# EAGLE design untitled (EAGLE 6.5.0)
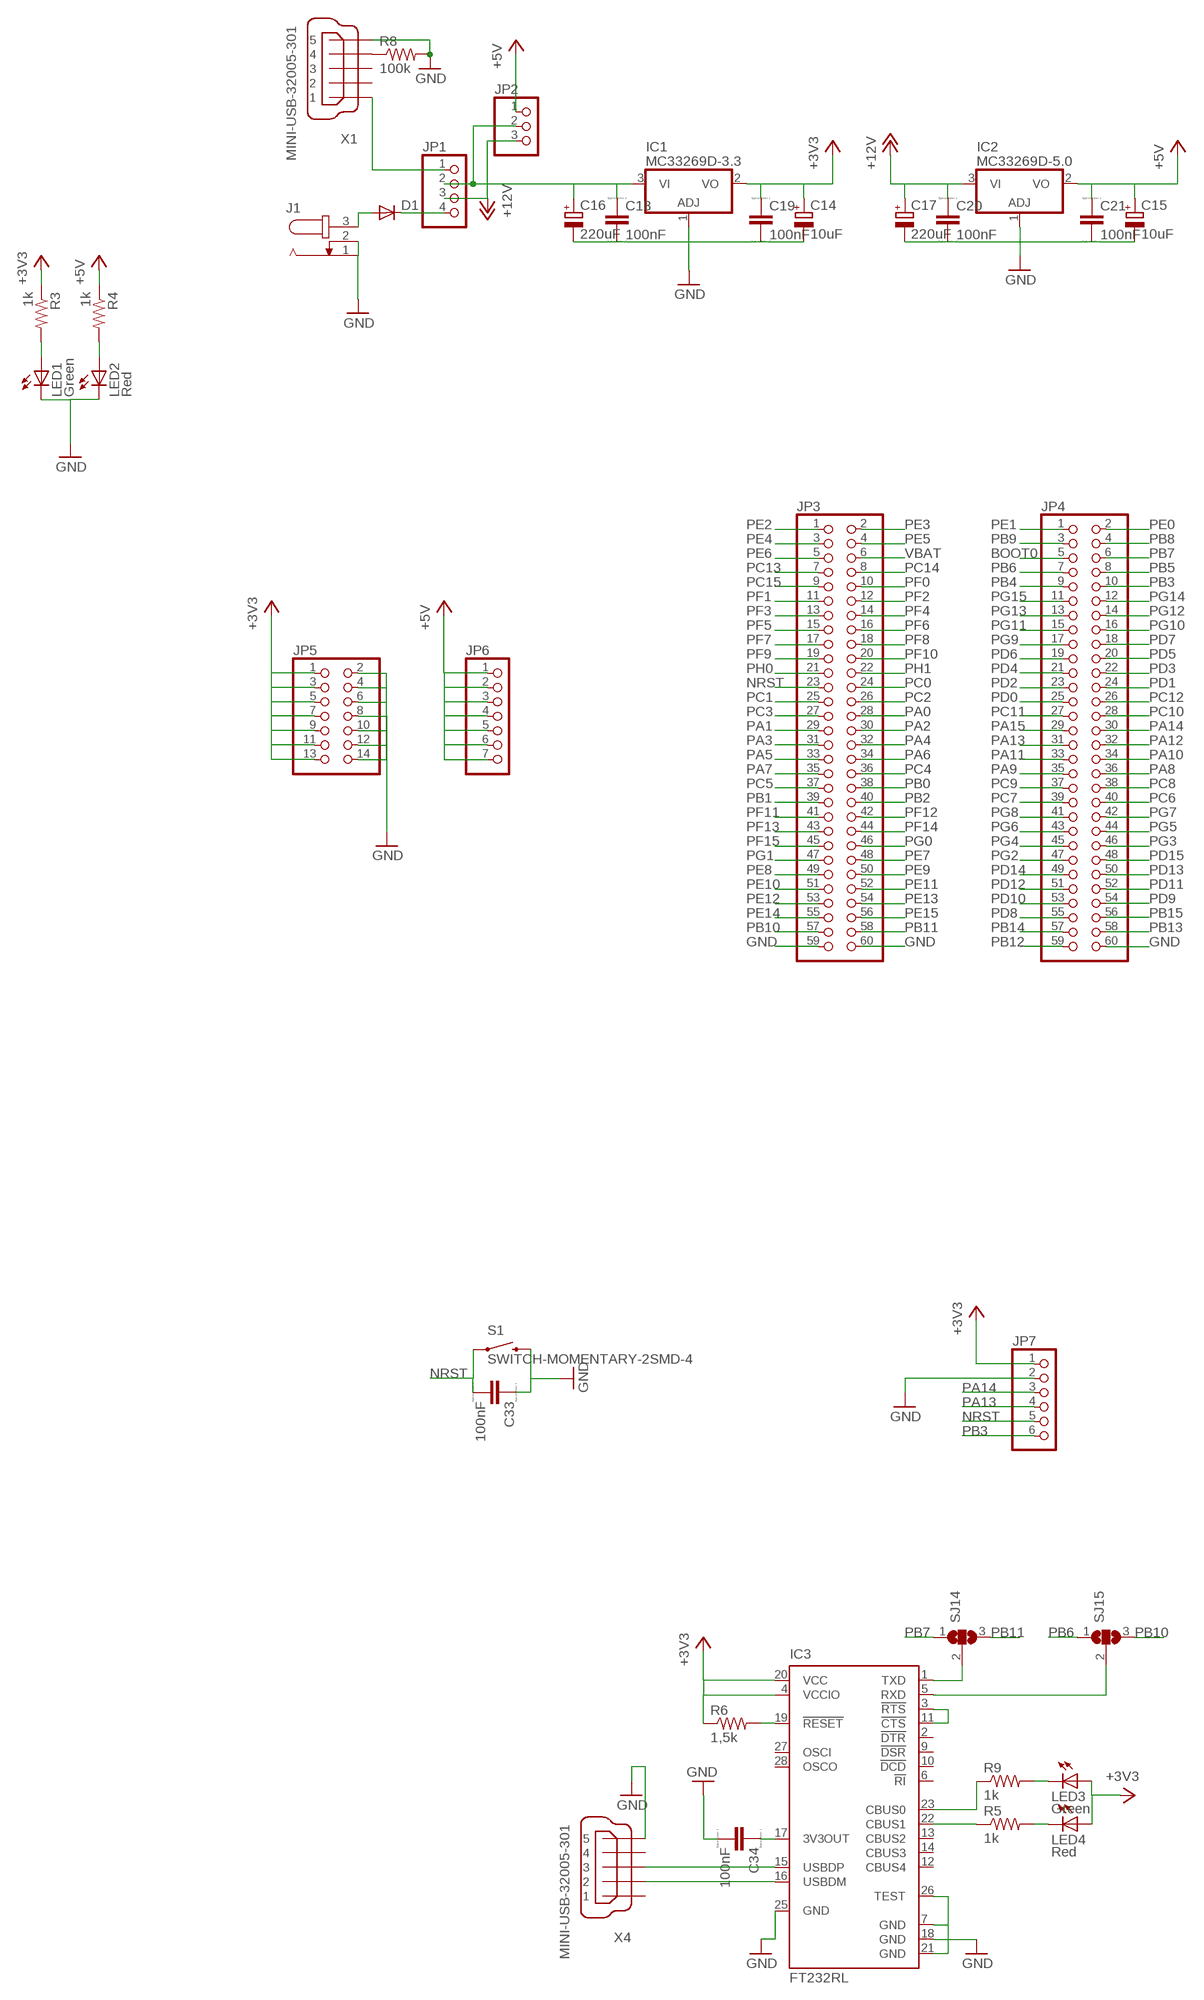
[diagram p0: schematic, sheet 1, part 1 of 2]
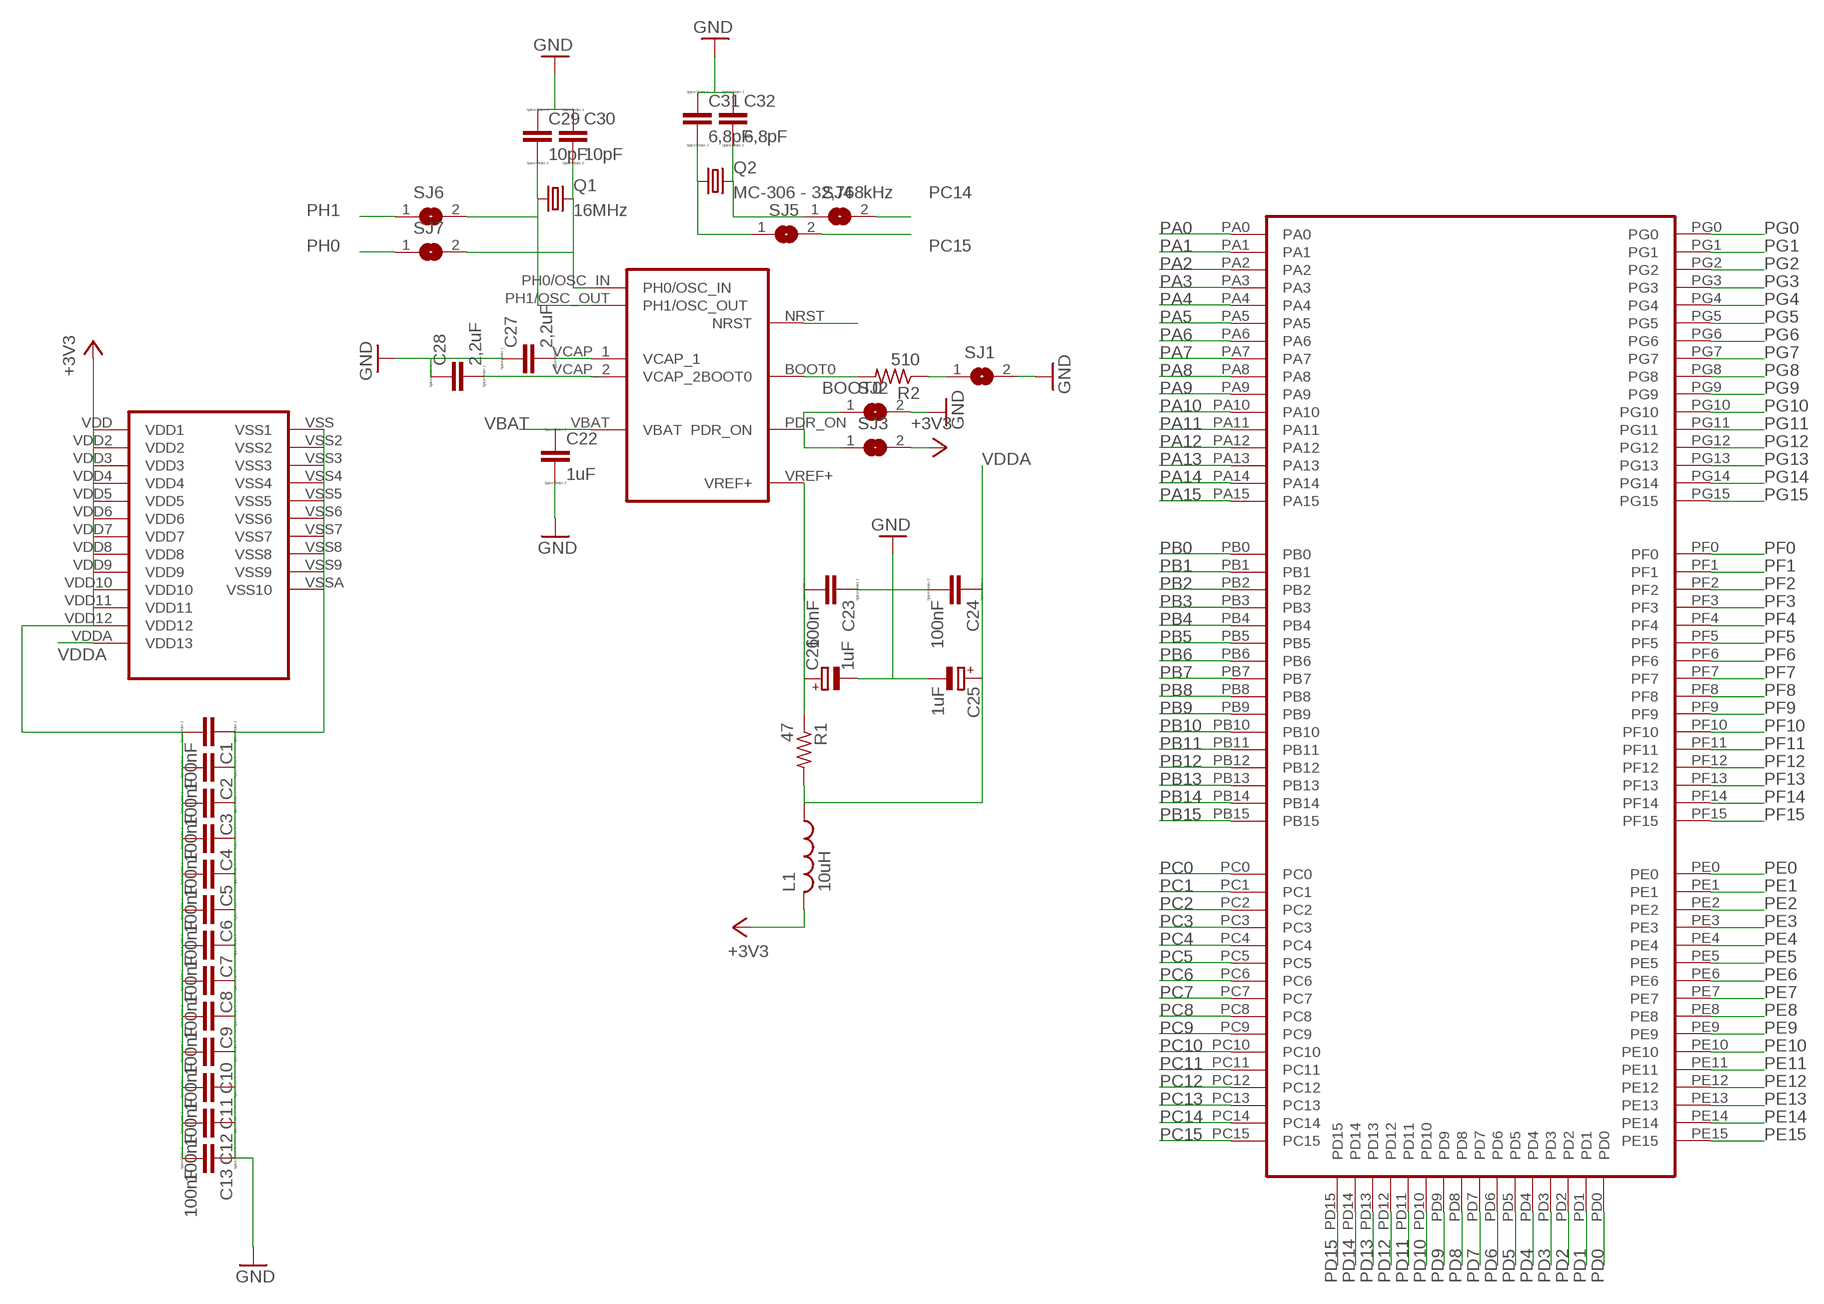
[diagram p1: schematic, sheet 1, part 2 of 2]

## Parts
C1  100nF  CC2012  [C2012]
C2  100nF  CC2012  [C2012]
C3  100nF  CC2012  [C2012]
C4  100nF  CC2012  [C2012]
C5  100nF  CC2012  [C2012]
C6  100nF  CC2012  [C2012]
C7  100nF  CC2012  [C2012]
C8  100nF  CC2012  [C2012]
C9  100nF  CC2012  [C2012]
C10  100nF  CC2012  [C2012]
C11  100nF  CC2012  [C2012]
C12  100nF  CC2012  [C2012]
C13  100nF  CC2012  [C2012]
C14  10uF  CPOL-EUSMCC  [SMC_C]
C15  10uF  CPOL-EUSMCC  [SMC_C]
C16  220uF  CPOL-EUD  [PANASONIC_D]
C17  220uF  CPOL-EUD  [PANASONIC_D]
C18  100nF  CC2012  [C2012]
C19  100nF  CC2012  [C2012]
C20  100nF  CC2012  [C2012]
C21  100nF  CC2012  [C2012]
C22  1uF  CC2012  [C2012]
C23  100nF  CC2012  [C2012]
C24  100nF  CC2012  [C2012]
C25  1uF  CPOL-EUSMCA  [SMC_A]
C26  1uF  CPOL-EUSMCA  [SMC_A]
C27  2,2uF  CC2012  [C2012]
C28  2,2uF  CC2012  [C2012]
C29  10pF  CC2012  [C2012]
C30  10pF  CC2012  [C2012]
C31  6,8pF  CC2012  [C2012]
C32  6,8pF  CC2012  [C2012]
C33  100nF  CC2012  [C2012]
C34  100nF  CC2012  [C2012]
D1  DIODE-SOD323-W  [SOD323-W]
IC1  MC33269D-3.3  [DPACK]
IC2  MC33269D-5.0  [DPACK]
IC3  FT232RL  [SSOP28]
J1  JACK-PLUG1  [SPC4078]
JP1  PINHD-1X4  [1X04]
JP2  PINHD-1X3  [1X03]
JP3  PINHD-2X30  [2X30]
JP4  PINHD-2X30  [2X30]
JP5  PINHD-2X7  [2X07]
JP6  PINHD-1X7  [1X07]
JP7  PINHD-1X6  [1X06]
L1  10uH  L-USL2012C  [L2012C]
LED1  Green  LEDCHIP-LED0805  [CHIP-LED0805]
LED2  Red  LEDCHIP-LED0805  [CHIP-LED0805]
LED3  Green  LEDCHIP-LED0805  [CHIP-LED0805]
LED4  Red  LEDCHIP-LED0805  [CHIP-LED0805]
Q1  16MHz  CRYSTALHC49UP  [HC49UP]
Q2  MC-306 - 32,768kHz  MC-306  [MC-306]
R1  47  R-US_R0805  [R0805]
R2  510  R-US_R0805  [R0805]
R3  1k  R-US_R0805  [R0805]
R4  1k  R-US_R0805  [R0805]
R5  1k  R-US_R0805  [R0805]
R6  1,5k  R-US_R0805  [R0805]
R8  100k  R-US_R0805  [R0805]
R9  1k  R-US_R0805  [R0805]
S1  SWITCH-MOMENTARY-2SMD-4  [TACTILE_SWITCH_TALL]
SJ1  SJ  [SJ]
SJ2  SJ  [SJ]
SJ3  SJ  [SJ]
SJ4  SJ  [SJ]
SJ5  SJ  [SJ]
SJ6  SJ  [SJ]
SJ7  SJ  [SJ]
SJ14  SJ2W  [SJ_2]
SJ15  SJ2W  [SJ_2]
U$1  STM32F407LQFP144  [LQFP144_20]
X1  MINI-USB-32005-301  [32005-301]
X4  MINI-USB-32005-301  [32005-301]

## Nets
+3V3: C1.2 C2.2 C3.2 C4.2 C5.2 C6.2 C7.2 C8.2 C9.2 C10.2 C11.2 C12.2 C13.2 C14.+ C19.1 IC1.2(VO) IC3.4(VCCIO) IC3.20(VCC) JP5.1 JP5.3 JP5.5 JP5.7 JP5.9 JP5.11 JP5.13 JP7.1 L1.2 LED3.A LED4.A R3.1 R6.1 SJ3.2 U$1.VDD2 U$1.VDD3 U$1.VDD4 U$1.VDD5 U$1.VDD6 U$1.VDD7 U$1.VDD8 U$1.VDD9 U$1.VDD10 U$1.VDD11 U$1.VDD12 U$1.VDD(VDD1)
+5V: C15.+ C21.1 IC2.2(VO) JP2.1 JP6.1 JP6.2 JP6.3 JP6.4 JP6.5 JP6.6 JP6.7 R4.1
+12V: C17.+ C20.1 IC2.3(VI) JP1.3 JP2.3
BOOT0: JP4.5 R2.2 U$1.BOOT0
GND: C1.1 C2.1 C3.1 C4.1 C5.1 C6.1 C7.1 C8.1 C9.1 C10.1 C11.1 C12.1 C13.1 C14.- C15.- C16.- C17.- C18.2 C19.2 C20.2 C21.2 C22.2 C23.1 C24.2 C25.- C26.- C27.1 C28.1 C29.1 C30.1 C31.1 C32.1 C33.1 C34.2 IC1.1(ADJ) IC2.1(ADJ) IC3.7(GND) IC3.18(GND) IC3.21(GND) IC3.25(GND) IC3.26(TEST) J1.1 J1.2 JP3.59 JP3.60 JP4.60 JP5.2 JP5.4 JP5.6 JP5.8 JP5.10 JP5.12 JP5.14 JP7.2 LED1.C LED2.C R8.2 S1.B2 SJ1.2 SJ2.2 U$1.VSS2 U$1.VSS3 U$1.VSS4 U$1.VSS5 U$1.VSS6 U$1.VSS7 U$1.VSS8 U$1.VSS9 U$1.VSS(VSS1) U$1.VSSA(VSS10) X1.5 X4.5
N$1: JP1.1 X1.1
N$2: D1.A J1.3
N$3: D1.C JP1.4
N$4: LED1.A R3.2
N$5: R2.1 SJ1.1
N$6: LED2.A R4.2
N$7: C16.+ C18.1 IC1.3(VI) JP1.2 JP2.2
N$8: C34.1 IC3.17(3V3OUT)
N$9: IC3.19(!RESET) R6.2
N$10: IC3.23(CBUS0) R9.1
N$11: IC3.16(USBDM) X4.2
N$12: IC3.15(USBDP) X4.3
N$13: R8.1 X1.4
N$14: IC3.1(TXD) SJ14.2
N$15: IC3.5(RXD) SJ15.2
N$24: SJ2.1 SJ3.1 U$1.PDR_ON
N$26: LED3.C R9.2
N$27: LED4.C R5.2
N$28: C31.2 Q2.1 SJ5.1
N$29: C32.2 Q2.4 SJ4.1
N$30: IC3.22(CBUS1) R5.1
N$31: IC3.3(!RTS) IC3.11(!CTS)
NRST: C33.2 JP3.23 JP7.5 S1.A2 U$1.NRST
OSC_IN: C30.2 Q1.2 SJ7.2 U$1.PH0/OSC_IN
OSC_OUT: C29.2 Q1.1 SJ6.2 U$1.PH1/OSC_OUT
PA0: JP3.28 U$1.PA0
PA1: JP3.29 U$1.PA1
PA2: JP3.30 U$1.PA2
PA3: JP3.31 U$1.PA3
PA4: JP3.32 U$1.PA4
PA5: JP3.33 U$1.PA5
PA6: JP3.34 U$1.PA6
PA7: JP3.35 U$1.PA7
PA8: JP4.36 U$1.PA8
PA9: JP4.35 U$1.PA9
PA10: JP4.34 U$1.PA10
PA11: JP4.33 U$1.PA11
PA12: JP4.32 U$1.PA12
PA13: JP4.31 JP7.4 U$1.PA13
PA14: JP4.30 JP7.3 U$1.PA14
PA15: JP4.29 U$1.PA15
PB0: JP3.38 U$1.PB0
PB1: JP3.39 U$1.PB1
PB2: JP3.40 U$1.PB2
PB3: JP4.10 JP7.6 U$1.PB3
PB4: JP4.9 U$1.PB4
PB5: JP4.8 U$1.PB5
PB6: JP4.7 SJ15.1 U$1.PB6
PB7: JP4.6 SJ14.1 U$1.PB7
PB8: JP4.4 U$1.PB8
PB9: JP4.3 U$1.PB9
PB10: JP3.57 SJ15.3 U$1.PB10
PB11: JP3.58 SJ14.3 U$1.PB11
PB12: JP4.59 U$1.PB12
PB13: JP4.58 U$1.PB13
PB14: JP4.57 U$1.PB14
PB15: JP4.56 U$1.PB15
PC0: JP3.24 U$1.PC0
PC1: JP3.25 U$1.PC1
PC2: JP3.26 U$1.PC2
PC3: JP3.27 U$1.PC3
PC4: JP3.36 U$1.PC4
PC5: JP3.37 U$1.PC5
PC6: JP4.40 U$1.PC6
PC7: JP4.39 U$1.PC7
PC8: JP4.38 U$1.PC8
PC9: JP4.37 U$1.PC9
PC10: JP4.28 U$1.PC10
PC11: JP4.27 U$1.PC11
PC12: JP4.26 U$1.PC12
PC13: JP3.7 U$1.PC13
PC14: JP3.8 SJ4.2 U$1.PC14
PC15: JP3.9 SJ5.2 U$1.PC15
PD0: JP4.25 U$1.PD0
PD1: JP4.24 U$1.PD1
PD2: JP4.23 U$1.PD2
PD3: JP4.22 U$1.PD3
PD4: JP4.21 U$1.PD4
PD5: JP4.20 U$1.PD5
PD6: JP4.19 U$1.PD6
PD7: JP4.18 U$1.PD7
PD8: JP4.55 U$1.PD8
PD9: JP4.54 U$1.PD9
PD10: JP4.53 U$1.PD10
PD11: JP4.52 U$1.PD11
PD12: JP4.51 U$1.PD12
PD13: JP4.50 U$1.PD13
PD14: JP4.49 U$1.PD14
PD15: JP4.48 U$1.PD15
PE0: JP4.2 U$1.PE0
PE1: JP4.1 U$1.PE1
PE2: JP3.1 U$1.PE2
PE3: JP3.2 U$1.PE3
PE4: JP3.3 U$1.PE4
PE5: JP3.4 U$1.PE5
PE6: JP3.5 U$1.PE6
PE7: JP3.48 U$1.PE7
PE8: JP3.49 U$1.PE8
PE9: JP3.50 U$1.PE9
PE10: JP3.51 U$1.PE10
PE11: JP3.52 U$1.PE11
PE12: JP3.53 U$1.PE12
PE13: JP3.54 U$1.PE13
PE14: JP3.55 U$1.PE14
PE15: JP3.56 U$1.PE15
PF0: JP3.10 U$1.PF0
PF1: JP3.11 U$1.PF1
PF2: JP3.12 U$1.PF2
PF3: JP3.13 U$1.PF3
PF4: JP3.14 U$1.PF4
PF5: JP3.15 U$1.PF5
PF6: JP3.16 U$1.PF6
PF7: JP3.17 U$1.PF7
PF8: JP3.18 U$1.PF8
PF9: JP3.19 U$1.PF9
PF10: JP3.20 U$1.PF10
PF11: JP3.41 U$1.PF11
PF12: JP3.42 U$1.PF12
PF13: JP3.43 U$1.PF13
PF14: JP3.44 U$1.PF14
PF15: JP3.45 U$1.PF15
PG0: JP3.46 U$1.PG0
PG1: JP3.47 U$1.PG1
PG2: JP4.47 U$1.PG2
PG3: JP4.46 U$1.PG3
PG4: JP4.45 U$1.PG4
PG5: JP4.44 U$1.PG5
PG6: JP4.43 U$1.PG6
PG7: JP4.42 U$1.PG7
PG8: JP4.41 U$1.PG8
PG9: JP4.17 U$1.PG9
PG10: JP4.16 U$1.PG10
PG11: JP4.15 U$1.PG11
PG12: JP4.14 U$1.PG12
PG13: JP4.13 U$1.PG13
PG14: JP4.12 U$1.PG14
PG15: JP4.11 U$1.PG15
PH0: JP3.21 SJ7.1
PH1: JP3.22 SJ6.1
VBAT: C22.1 JP3.6 U$1.VBAT
VCAP1: C27.2 U$1.VCAP_1
VCAP2: C28.2 U$1.VCAP_2
VDDA: C24.1 C25.+ L1.1 R1.2 U$1.VDDA(VDD13)
VREF+: C23.2 C26.+ R1.1 U$1.VREF+
Unconnected: IC3.2(!DTR) IC3.6(!RI) IC3.9(!DSR) IC3.10(!DCD) IC3.12(CBUS4) IC3.13(CBUS2) IC3.14(CBUS3) IC3.27(OSCI) IC3.28(OSCO) X1.2 X1.3 X4.1 X4.4

## Library data of the parts
C1-C13 C18-C24 C27-C34 = eagle-ltspice:C: CAPACITOR, European symbol; SPICEMODEL: NONE; SPICEPREFIX: C
C14-C17 = resistor:CPOL-EU: POLARIZED CAPACITOR, European symbol
C25 C26 = rcl:CPOL-EU: POLARIZED CAPACITOR, European symbol
D1 = diode:DIODE-: DIODE
IC1 IC2 = linear:MC33269?*: Adjustable Output Low Dropout Voltage Regulator 800 mA Source: http://www.onsemi.com/pub/Collateral/MC33269-D.PDF
IC3 = ftdichip:FT232R: Source: http://www.ftdichip.com/Documents/DataSheets/DS_FT232R_v104.pdf; MPN: FT232RL; OC_FARNELL: 1146032; OC_NEWARK: 91K9918
J1 = con-jack:JACK-PLUG: DC POWER JACK Power Jack, DC, Right Angle, Through Hole, Rated 5A at 16VDC, PC Terminals Distributor: Farnell (www.Farnell.de) Drawing: 84N1161.pdf / 84N1162.pdf Manufacturer: SPC Technology (www.spctechnology.com) Type: SPC4077 / SPC 4078; OC_FARNELL: unknown; OC_NEWARK: unknown
JP1 = pinhead:PINHD-1X4: PIN HEADER
JP2 = pinhead:PINHD-1X3: PIN HEADER
JP3 JP4 = pinhead:PINHD-2X30: PIN HEADER
JP5 = pinhead:PINHD-2X7: PIN HEADER
JP6 = pinhead:PINHD-1X7: PIN HEADER
JP7 = pinhead:PINHD-1X6: PIN HEADER
L1 = rcl:L-US: INDUCTOR, American symbol
LED1-LED4 = led:LED: LED OSRAM: - CHIPLED LG R971, LG N971, LY N971, LG Q971, LY Q971, LO R971, LY R971 LH N974, LH R974 LS Q976, LO Q976, LY Q976 LO Q996 - Hyper CHIPLED LW Q18S LB Q993, LB Q99A, LB R99A - SideLED LS A670, LO A670, LY A670, LG A670, LP A670 LB A673, LV A673, LT A673, LW A673 LH A674 LY A675 LS A676, LA A676, LO A676, LY A676, LW A676 LS A679, LY A679, LG A679 - Hyper Micro SIDELED® LS Y876, LA Y876, LO Y876, LY Y876 LT Y87S - SmartLED LW L88C, LW L88S LB L89C, LB L89S, LG L890 LS L89K, LO L89K, LY L89K LS L896, LA L896, LO L896, LY L896 - TOPLED LS T670, LO T670, LY T670, LG T670, LP T670 LSG T670, LSP T670, LSY T670, LOP T670, LYG T670 LG T671, LOG T671, LSG T671 LB T673, LV T673, LT T673, LW T673 LH T674 LS T676, LA T676, LO T676, LY T676, LB T676, LH T676, LSB T676, LW T676 LB T67C, LV T67C, LT T67C, LS T67K, LO T67K, LY T67K, LW E67C LS E67B, LA E67B, LO E67B, LY E67B, LB E67C, LV E67C, LT E67C LW T67C LS T679, LY T679, LG T679 LS T770, LO T770, LY T770, LG T770, LP T770 LB T773, LV T773, LT T773, LW T773 LH T774 LS E675, LA E675, LY E675, LS T675 LS T776, LA T776, LO T776, LY T776, LB T776 LHGB T686 LT T68C, LB T68C - Hyper Mini TOPLED® LB M676 - Mini TOPLED Santana® LG M470 LS M47K, LO M47K, LY M47K Source: http://www.osram.convergy.de LUXEON: - LUMILED® LXK2-PW12-R00, LXK2-PW12-S00, LXK2-PW14-U00, LXK2-PW14-V00 LXK2-PM12-R00, LXK2-PM12-S00, LXK2-PM14-U00 LXK2-PE12-Q00, LXK2-PE12-R00, LXK2-PE12-S00, LXK2-PE14-T00, LXK2-PE14-U00 LXK2-PB12-K00, LXK2-PB12-L00, LXK2-PB12-M00, LXK2-PB14-N00, LXK2-PB14-P00, LXK2-PB14-Q00 LXK2-PR12-L00, LXK2-PR12-M00, LXK2-PR14-Q00, LXK2-PR14-R00 LXK2-PD12-Q00, LXK2-PD12-R00, LXK2-PD12-S00 LXK2-PH12-R00, LXK2-PH12-S00 LXK2-PL12-P00, LXK2-PL12-Q00, LXK2-PL12-R00 Source: www.luxeon.com KINGBRIGHT: KA-3528ASYC Source: www.kingbright.com
Q1 = crystal:CRYSTAL: CRYSTAL; OC_FARNELL: unknown; OC_NEWARK: unknown
Q2 = crystal:MC-306: kHz RANGE CRYSTAL UNIT SMD Source: MC-306_405_406_E07X.PDF Homepage <http://www.epsontoyocom.co.jp>; MPN: MC-306 60.0KHZ 100PPM ,12.5PF; OC_FARNELL: 1278040; OC_NEWARK: 31M5576
R1-R6 R8 R9 = resistor:R-US_: RESISTOR, American symbol
S1 = SparkFun-Electromechanical:SWITCH-MOMENTARY-2: Various NO switches- pushbuttons, reed, etc; PROD_ID: SWCH-11966
SJ1-SJ7 = jumper:SJ: SMD solder JUMPER
SJ14 SJ15 = jumper:SJ2W: SMD solder JUMPER
U$1 = Stworzone:STM32F407
X1 X4 = con-cypressindustries:MINI-USB-: MINI USB-B Conector Source: www.cypressindustries.com; OC_FARNELL: unknown; OC_NEWARK: unknown

## Board
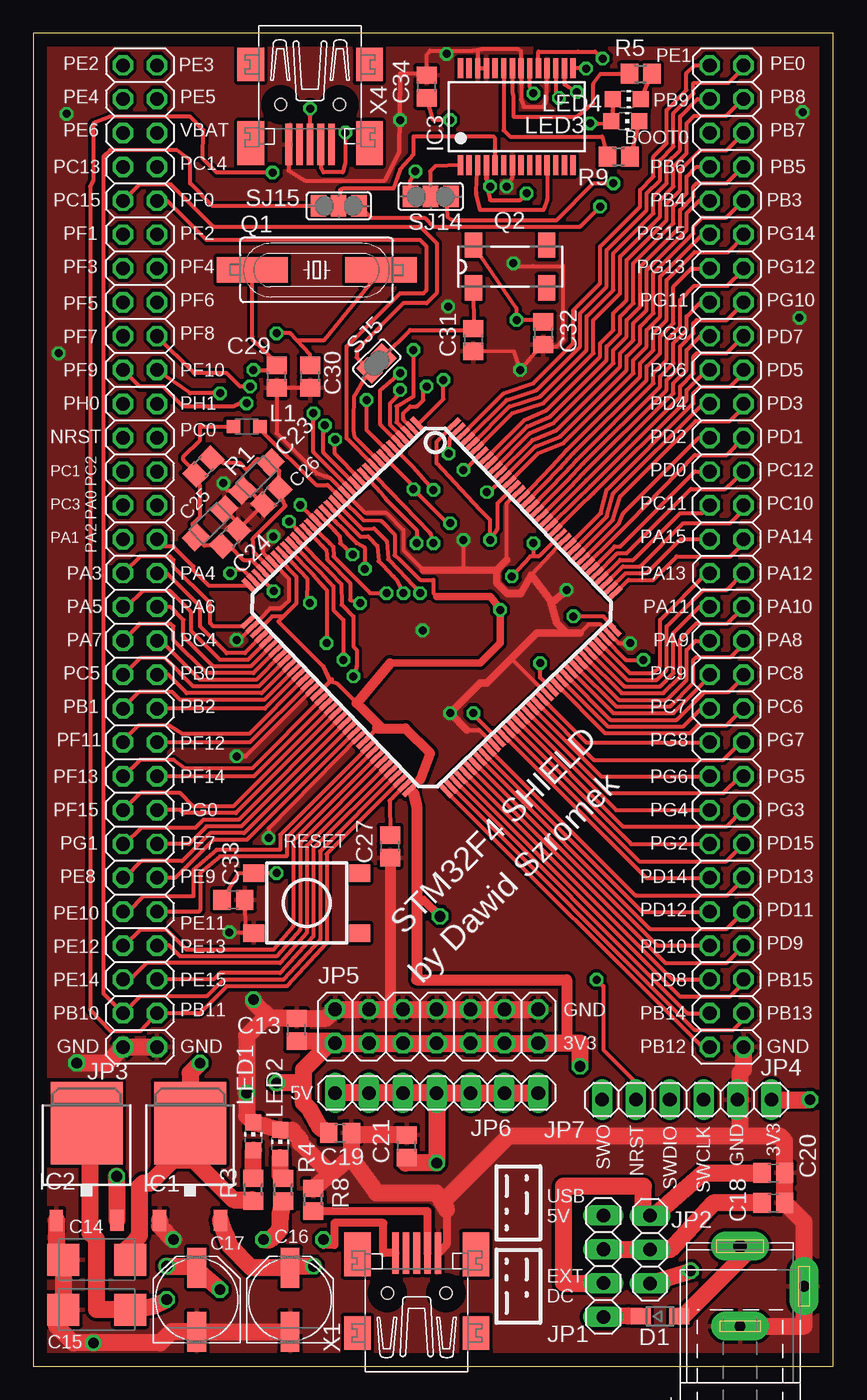
[diagram p2: board, top side]
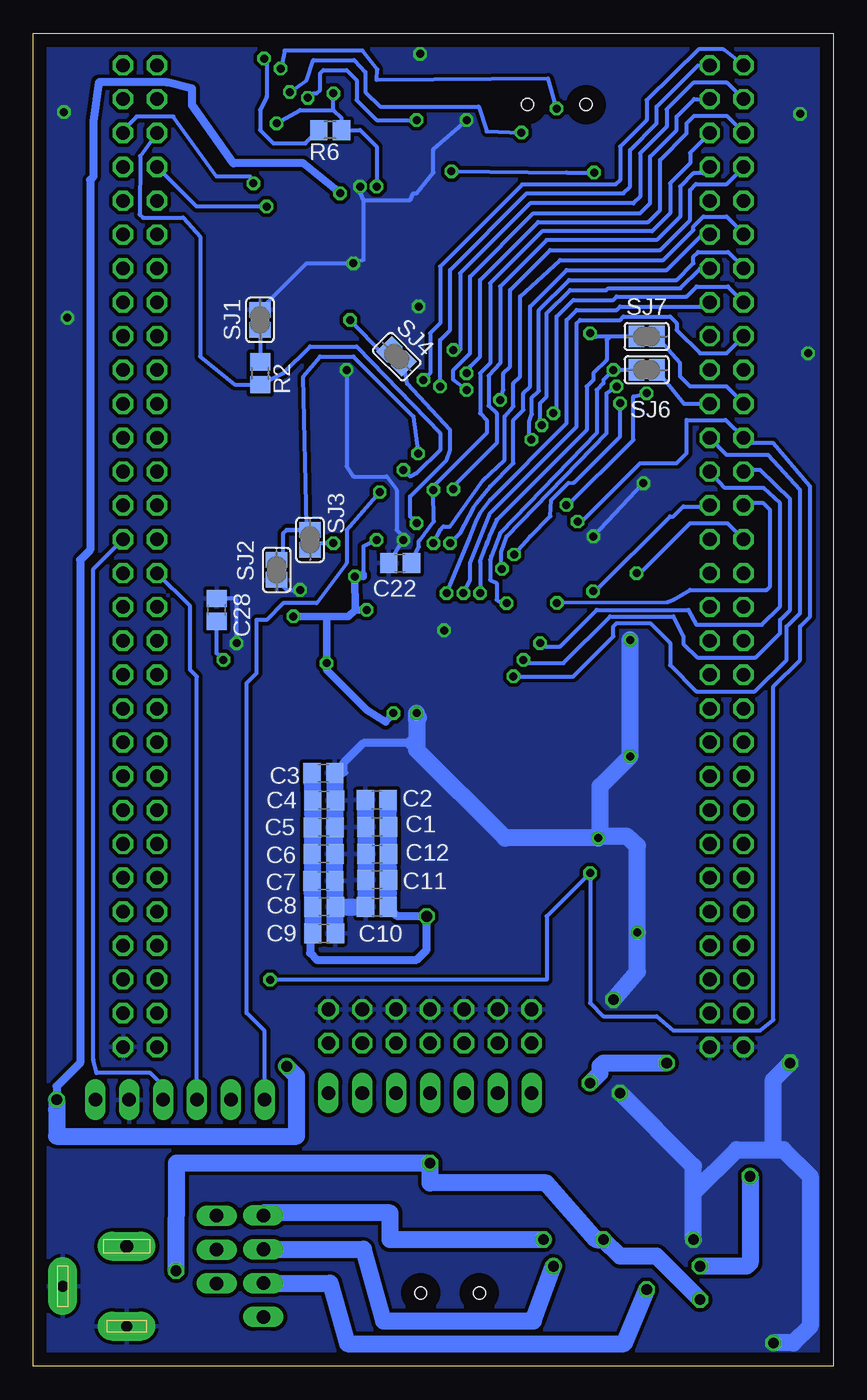
[diagram p3: board, bottom side, seen from below]

Size 60 x 100 mm. Coordinates in mm from the lower left corner, seen from the top.
Outline: 0,0 60,0 60,100 0,100 0,0
Copper layers (1*16): Top 0.035mm / dielectric 1.5mm / Bottom 0.035mm
Design rules "elecrow": minimum track width 10mil, minimum drill 12mil, track to track 8mil, track to pad 8mil, pad to pad 8mil, via to via 8mil, smd to smd 8mil, copper to edge 40mil, drill to drill 8mil, minimum pad ring 10mil, minimum via ring 8mil, stop-mask expansion 4mil, vias tented up to drill 0mil, thermal gap 10mil

### Footprints (pad centres in the part's own frame; a part is rotated, then mirrored left to right if it is on the bottom)
C2012 = smd 1.3 x 1.5: 1 -0.85,0; 2 0.85,0
SMC_C = smd 2.4 x 2.4: + -2.5,0; - 2.5,0
PANASONIC_D = smd 3 x 1.4: + 2.4,0; - -2.4,0
SMC_A = smd 1.6 x 1.4: + -1.5,0; - 1.5,0
SOD323-W = smd 1.5 x 1.2: A 1.45,0; C -1.45,0
DPACK = smd 1 x 1.6: 1 -2.28,-4.8; 3 2.28,-4.8 | smd 5.4 x 6.2: 2 0,2.5
SSOP28 = smd 0.4 x 1.5: 1 -4.225,-3.625; 2 -3.575,-3.625; 3 -2.925,-3.625; 4 -2.275,-3.625; 5 -1.625,-3.625; 6 -0.975,-3.625; 7 -0.325,-3.625; 8 0.325,-3.625; 9 0.975,-3.625; 10 1.625,-3.625; 11 2.275,-3.625; 12 2.925,-3.625; 13 3.575,-3.625; 14 4.225,-3.625; 15 4.225,3.625; 16 3.575,3.625; 17 2.925,3.625; 18 2.275,3.625; 19 1.625,3.625; 20 0.975,3.625; 21 0.325,3.625; 22 -0.325,3.625; 23 -0.975,3.625; 24 -1.625,3.625; 25 -2.275,3.625; 26 -2.925,3.625; 27 -3.575,3.625; 28 -4.225,3.625
SPC4078 = drill 0.8 pad 2.184 long: 1 -3,0; 2 0,-4.8 | drill 1 pad 2.184 long: 3 3,0
1X04 = drill 1.016 long: 1 -3.81,0; 2 -1.27,0; 3 1.27,0; 4 3.81,0
1X03 = drill 1.016 long: 1 -2.54,0; 2 0,0; 3 2.54,0
2X30 = drill 1.016 octagon: 1 -38.1,-1.27; 2 -38.1,1.27; 3 -35.56,-1.27; 4 -35.56,1.27; 5 -33.02,-1.27; 6 -33.02,1.27; 7 -30.48,-1.27; 8 -30.48,1.27; 9 -27.94,-1.27; 10 -27.94,1.27; 11 -25.4,-1.27; 12 -25.4,1.27; 13 -22.86,-1.27; 14 -22.86,1.27; 15 -20.32,-1.27; 16 -20.32,1.27; 17 -17.78,-1.27; 18 -17.78,1.27; 19 -15.24,-1.27; 20 -15.24,1.27; 21 -12.7,-1.27; 22 -12.7,1.27; 23 -10.16,-1.27; 24 -10.16,1.27; 25 -7.62,-1.27; 26 -7.62,1.27; 27 -5.08,-1.27; 28 -5.08,1.27; 29 -2.54,-1.27; 30 -2.54,1.27; 31 0,-1.27; 32 0,1.27; 33 2.54,-1.27; 34 2.54,1.27; 35 5.08,-1.27; 36 5.08,1.27; 37 7.62,-1.27; 38 7.62,1.27; 39 10.16,-1.27; 40 10.16,1.27; 41 12.7,-1.27; 42 12.7,1.27; 43 15.24,-1.27; 44 15.24,1.27; 45 17.78,-1.27; 46 17.78,1.27; 47 20.32,-1.27; 48 20.32,1.27; 49 22.86,-1.27; 50 22.86,1.27; 51 25.4,-1.27; 52 25.4,1.27; 53 27.94,-1.27; 54 27.94,1.27; 55 30.48,-1.27; 56 30.48,1.27; 57 33.02,-1.27; 58 33.02,1.27; 59 35.56,-1.27; 60 35.56,1.27
2X07 = drill 1.016 octagon: 1 -7.62,-1.27; 2 -7.62,1.27; 3 -5.08,-1.27; 4 -5.08,1.27; 5 -2.54,-1.27; 6 -2.54,1.27; 7 0,-1.27; 8 0,1.27; 9 2.54,-1.27; 10 2.54,1.27; 11 5.08,-1.27; 12 5.08,1.27; 13 7.62,-1.27; 14 7.62,1.27
1X07 = drill 1.016 long: 1 -7.62,0; 2 -5.08,0; 3 -2.54,0; 4 0,0; 5 2.54,0; 6 5.08,0; 7 7.62,0
1X06 = drill 1.016 long: 1 -6.35,0; 2 -3.81,0; 3 -1.27,0; 4 1.27,0; 5 3.81,0; 6 6.35,0
L2012C = smd 1 x 1: 1 -1,0; 2 1,0
CHIP-LED0805 = smd 1.2 x 1.2: A 0,-1.05; C 0,1.05
HC49UP = smd 5.334 x 1.93: 1 -4.826,0; 2 4.826,0
MC-306 = smd 1.3 x 1.9: 1 -2.75,-1.6; 2 2.75,-1.6; 3 2.75,1.6; 4 -2.75,1.6
R0805 = smd 1.3 x 1.5: 1 -0.85,0; 2 0.85,0
TACTILE_SWITCH_TALL = smd 1.55 x 1.3: A1 -3.975,-2.25; A2 3.975,-2.25; B1 -3.975,2.25; B2 3.975,2.25
SJ = smd 1.168 x 1.6: 1 -0.762,0; 2 0.762,0
SJ_2 = smd 1.168 x 1.6: 1 -1.524,0; 2 0,0; 3 1.524,0
LQFP144_20 = smd 0.35 x 1.35: BOOT0 -5.75,10.625; PA3 -8.75,-10.625; PA4 -7.25,-10.625; PA5 -6.75,-10.625; PA6 -6.25,-10.625; PA7 -5.75,-10.625; PA14 8.75,10.625; PA15 8.25,10.625; PB0 -4.25,-10.625; PB1 -3.75,-10.625; PB2 -3.25,-10.625; PB3 -3.25,10.625; PB4 -3.75,10.625; PB5 -4.25,10.625; PB6 -4.75,10.625; PB7 -5.25,10.625; PB8 -6.25,10.625; PB9 -6.75,10.625; PB10 7.25,-10.625; PB11 7.75,-10.625; PC4 -5.25,-10.625; PC5 -4.75,-10.625; PC10 7.75,10.625; PC11 7.25,10.625; PC12 6.75,10.625; PD0 6.25,10.625; PD1 5.75,10.625; PD2 5.25,10.625; PD3 4.75,10.625; PD4 4.25,10.625; PD5 3.75,10.625; PD6 2.25,10.625; PD7 1.75,10.625; PDR_ON -8.25,10.625; PE0 -7.25,10.625; PE1 -7.75,10.625; PE7 1.75,-10.625; PE8 2.25,-10.625; PE9 2.75,-10.625; PE10 4.25,-10.625; PE11 4.75,-10.625; PE12 5.25,-10.625; PE13 5.75,-10.625; PE14 6.25,-10.625; PE15 6.75,-10.625; PF11 -2.75,-10.625; PF12 -2.25,-10.625; PF13 -0.75,-10.625; PF14 -0.25,-10.625; PF15 0.25,-10.625; PG0 0.75,-10.625; PG1 1.25,-10.625; PG9 1.25,10.625; PG10 0.75,10.625; PG11 0.25,10.625; PG12 -0.25,10.625; PG13 -0.75,10.625; PG14 -1.25,10.625; PG15 -2.75,10.625; VCAP_1 8.25,-10.625; VDD3 -7.75,-10.625; VDD4 -1.25,-10.625; VDD5 3.75,-10.625; VDD6 8.75,-10.625; VDD10 2.75,10.625; VDD11 -2.25,10.625; VDD12 -8.75,10.625; VSS2 -8.25,-10.625; VSS3 -1.75,-10.625; VSS4 3.25,-10.625; VSS8 3.25,10.625; VSS9 -1.75,10.625 | smd 1.35 x 0.35: NRST -10.625,-3.25; PA0 -10.625,-7.75; PA1 -10.625,-8.25; PA2 -10.625,-8.75; PA8 10.625,4.75; PA9 10.625,5.25; PA10 10.625,5.75; PA11 10.625,6.25; PA12 10.625,6.75; PA13 10.625,7.25; PB12 10.625,-8.75; PB13 10.625,-8.25; PB14 10.625,-7.75; PB15 10.625,-7.25; PC0 -10.625,-3.75; PC1 -10.625,-4.25; PC2 -10.625,-4.75; PC3 -10.625,-5.25; PC6 10.625,2.75; PC7 10.625,3.25; PC8 10.625,3.75; PC9 10.625,4.25; PC13 -10.625,5.75; PC14 -10.625,5.25; PC15 -10.625,4.75; PD8 10.625,-6.75; PD9 10.625,-6.25; PD10 10.625,-5.75; PD11 10.625,-5.25; PD12 10.625,-4.75; PD13 10.625,-4.25; PD14 10.625,-2.75; PD15 10.625,-2.25; PE2 -10.625,8.75; PE3 -10.625,8.25; PE4 -10.625,7.75; PE5 -10.625,7.25; PE6 -10.625,6.75; PF0 -10.625,4.25; PF1 -10.625,3.75; PF2 -10.625,3.25; PF3 -10.625,2.75; PF4 -10.625,2.25; PF5 -10.625,1.75; PF6 -10.625,0.25; PF7 -10.625,-0.25; PF8 -10.625,-0.75; PF9 -10.625,-1.25; PF10 -10.625,-1.75; PG2 10.625,-1.75; PG3 10.625,-1.25; PG4 10.625,-0.75; PG5 10.625,-0.25; PG6 10.625,0.25; PG7 10.625,0.75; PG8 10.625,1.25; PH0/OSC_IN -10.625,-2.25; PH1/OSC_OUT -10.625,-2.75; VBAT -10.625,6.25; VCAP_2 10.625,7.75; VDD -10.625,0.75; VDD2 -10.625,-5.75; VDD7 10.625,-3.25; VDD8 10.625,2.25; VDD9 10.625,8.75; VDDA -10.625,-7.25; VREF+ -10.625,-6.75; VSS -10.625,1.25; VSS5 10.625,-3.75; VSS6 10.625,1.75; VSS7 10.625,8.25; VSSA -10.625,-6.25
32005-301 = smd 3.1 x 0.5: 1 3,1.6; 2 3,0.8; 3 3,0; 4 3,-0.8; 5 3,-1.6 | smd 2.5 x 2: M1 -3,-4.45; M2 -3,4.45 | smd 3.3 x 2: M3 2.9,4.45; M4 2.9,-4.45 | hole 0.9: 0,2.2; 0,-2.2

### Placement (x,y rotation side)
C1  34.22,40.46 0 bottom
C2  34.25,42.48 0 bottom
C3  38.25,44.5 180 bottom
C4  38.2,42.46 180 bottom
C5  38.22,40.43 180 bottom
C6  38.23,38.45 180 bottom
C7  38.24,36.42 180 bottom
C8  38.19,34.46 180 bottom
C9  38.2,32.47 180 bottom
C10  34.23,34.44 0 bottom
C11  34.22,36.49 0 bottom
C12  34.21,38.42 0 bottom
C13  19.75,25.25 270 top
C14  4.75,8 180 top
C15  4.75,4.25 180 top
C16  19.25,5 90 top
C17  12.25,5 90 top
C18  55.5,12.25 0 top
C19  23,17.5 0 top
C20  55.5,14.5 0 top
C21  28,16.5 90 top
C22  32.5,60.25 180 bottom
C23  17.85,65.25 45 top
C24  14.75,62.16 45 top
C25  13.25,63.25 45 top
C26  16.75,66.75 225 top
C27  26.75,39 90 top
C28  46.25,56.75 270 bottom
C29  18.25,74.25 90 top
C30  20.75,74.25 90 top
C31  33,77 90 top
C32  38.25,77.5 90 top
C33  15,35 180 top
C34  29.5,96 90 top
D1  47,3.75 0 top
IC1  11.75,15.75 0 top
IC2  4,15.75 0 top
IC3  36.25,93.75 0 top
J1  53,6 90 top
JP1  42.75,7.5 270 top
JP2  46.25,8.75 90 top
JP3  8,59.5 270 top
JP4  52,59.5 270 top
JP5  30.25,25.5 0 top
JP6  30.25,20.5 0 top
JP7  49,20 180 top
L1  16,70.5 0 top
LED1  16.5,17.25 0 top
LED2  18.5,16.7 0 top
LED3  44.4,93.4 270 top
LED4  44.5,95.05 270 top
Q1  21.25,82.25 0 top
Q2  35.75,82.5 0 top
R1  12.75,67.5 225 top
R2  43,74.5 270 bottom
R3  16.5,13.25 90 top
R4  18.75,13.25 90 top
R5  45.55,96.95 0 top
R6  37.75,92.75 180 bottom
R8  21,12.5 90 top
R9  43.9,90.75 0 top
S1  20.5,34.75 180 top
SJ1  43,78.5 90 bottom
SJ2  41.75,59.75 270 bottom
SJ3  39.25,62 270 bottom
SJ4  32.75,75.75 315 bottom
SJ5  25.75,75.25 225 top
SJ6  14,74.75 180 bottom
SJ7  14,77.25 180 bottom
SJ14  29.8,87.75 180 top
SJ15  22.9,87.05 180 top
U$1  29.87,56.93 313.8 top
X1  28.75,5.5 90 top
X4  20.75,94.65 270 top

### Tracks (layer width: path | path; a pad name or v marks a point on that pad's centre or on a via)
+3V3  (via drill 0.6, 0.8)
  Top 0.292: 28.5,43 28.5,43.02 U$1.VDD6 29,44 | v33,49 33,48.89 U$1.VDD7 | U$1.VDD2 18.38,60.62 19.73,59.23 19.73,57.22 18.75,56.25 | 18.75,56.25 18.38,55.88 21.75,52.5 | 18.75,56.25 17.92,56.25 U$1.VDD3 | U$1.VDD4 21.39,50.48 | 21.39,50.48 22.28,51.37 21.78,52.47 21.75,52.5 | 22.39,51.36 22.25,51.5 21.75,52.5 | 21.39,50.48 21.39,50.52 22.39,51.52 22.39,51.36 | 22.39,51.36 22.75,51.25 24.25,49.75 | 26,48 25.75,47.82 U$1.VDD5 24.8,46.89 25.76,47.85 | U$1.VDD11 34.82,64.75 34.82,62.82 34.75,62.75 v34.25,62 34.25,63.5 33.5,64.25 30.25,67.75 30.25,69.37 U$1.VDD12 | U$1.VDD10 37.89,60.76 37.5,60.76 | 37.5,60.76 37.26,60.76 v35.88,59.25 | U$1.VDD9 43.54,55.46 42.75,56.25 v40.5,56.25 | L1.2 17.06,70.25 21.2,66.11 22.07,66.11 U$1.VDD 24.77,63.45 26.13,63.4 27.1,62.4 27.1,60.85 27.5,60.5 29,59 30,59 30,58 30.25,57.75 | U$1.VDD8 38,51.67 v38,52.75 | v37.5,61.75 37.5,60.76 | 43.45,94.2 LED3.A | LED4.A 43.45,94.2 | 43.45,94.2 43.45,93.1 42.35,93.2 v41.75,93.25 | v37.5,95.5 37.23,96.03 IC3.20 | v34.25,88.5 33.98,89.03 IC3.4 34,90.35 34,88.75 v34.25,88.5 | v34.25,88.5 34,88.5 34.25,87.5 36.5,87.5 v37,88
  Top 0.559: 26.75,52.75 33.5,52.75 35,54.25 v35,56.75 34.5,57.5 34.25,57.75 30.25,57.75
  Top 0.61: v30.5,33.75 29.25,35 28.75,35
  Top 0.762: 26.75,52.75 24.25,49.75 26,48 | 25.76,47.85 27.9,47.85 29.75,46 29,44
  Top 0.813: 28.5,43 28.75,42 28.75,35 28.75,29 40,29 40,24.23
  Top 1.27: C14.+ 6.75,8.5 7.75,9.5 7.75,9.54 7.9,9.69 7.9,9.77 7.98,9.85 7.98,13.48 8.25,13.75 8.75,13.75 10.5,15.5 | 10.5,15.5 10.5,17 IC1.2 11.75,22 v12.5,22.75 | 10.5,15.5 12,15.5 15,12.5 16.4,12.5 R3.1 | C13.2 22.46,24.4 JP5.1 | JP5.1 JP5.3 JP5.5 JP5.7 JP5.9 JP5.11 JP5.13 40,24.23 41.02,24.23 v41,22.5 | JP5.1 22.23,24.23 20.25,22.25 20.25,21 | C19.1 21.5,17.9 20.75,19.25 20.25,19.75 20.25,21 | 20.25,21 20,21.25 v18.25,21.25 | JP7.1 v58.25,20
  Bottom 0.292: 33,49.1 v33,49 v33,48.99 | SJ3.2 38.74,61.75 v37.5,61.75 | v41.75,93.25 40,94.25 37.5,94.25 | 37.5,94.25 36.9,93.65 R6.1 35.5,92.75 34.25,91.5 v34.25,88.5 | 37.5,94.25 v37.5,95.5 | 38,56 37.75,56.25 | v34.25,62 35.25,61.5 35.25,59.38
  Bottom 0.559: 35.87,56.75 v35.88,59.25 35.25,59.38 35.25,59.25 | v40.5,56.25 37.75,56.25 36.37,56.25 35.87,56.75 | v33,48.99 33.57,48.32 35,49.25 38,52.25 v38,52.75 38,56 | v35,56.75 35.87,56.75
  Bottom 0.61: v37,88 39.75,90.25 45,90.25 48.1,94.6 48.09,95.85 49.99,96.33 55.08,96.33 55.5,93.41 55.5,89.25 55.75,89 55.75,61.25 56.5,60.5 56.5,22.75 58.25,21 58.25,19.25 | C9.2 39.25,32.27 39.25,31 38.75,30.5 31.25,30.5 30.5,31.25 v30.5,33.75 32.69,33.75 C10.2
  Bottom 1.27: v18.25,21.25 17.5,22 17.5,22.5 17.25,22.75 v12.5,22.75 | v58.25,20 58.25,19.25 58.25,17.25 40.25,17.25 40.25,21.75 v41,22.5 | C3.2 39.1,43.76 C4.2 39.05,41.45 C5.2 39.07,38.96 C6.2 39.08,37.43 C7.2 39.09,35.51 C8.2 39.04,33.73 C9.2 | C10.2 33.38,35.48 C11.2 33.37,37.41 C12.2 33.36,39.2 C1.2 33.37,41.7 C2.2
+5V  (via drill 0.8)
  Top 1.27: JP2.1 v49.29,7.16 | C21.1 27.9,15.25 v30.25,15.25 JP6.4 | JP6.4 JP6.3 JP6.2 JP6.1 | JP6.4 JP6.5 JP6.6 JP6.7 | IC2.2 4.25,16.5 4.25,10 4.75,9.5 4.75,4.25 C15.+ 9,4.5 v10,5 | v17.25,9.5 17.28,9.5 | 17.28,9.5 17.75,9.5 18.46,10.21 | 18.46,10.21 18.5,10.25 18.5,11.4 R4.1 18.53,11.46 18.49,10.5 18.48,10.41 18.49,10.27 18.46,10.21 | 18.46,10.21 17.75,9.52 17.28,9.5
  Bottom 1.27: v49.29,7.16 49.25,15.25 v30.25,15.25 30.25,13.75 21.53,13.75 17.78,9.5 17.87,9.59 17.87,9.62 17.75,9.5 v17.25,9.5 16,8.25 13.25,8.25 v10,5
+12V  (via drill 0.8)
  Top 1.27: C20.1 50.25,14.5 46.5,11.25 JP2.3 45.75,11.29 45.75,13.5 39.75,13.5 39.75,6.23 JP1.3 | v14,5.75 12.25,7.25 C17.+ 12.15,7.5 v10,7.5 | IC2.3 6.28,13.22 v6.25,14.25
  Bottom 1.27: JP1.3 37.75,6.23 36.45,1.7 15.7,1.7 v14,5.75 | v6.25,14.25 6.25,7.75 6.5,7.5 v10,7.5
BOOT0  (via drill 0.6)
  Top 0.292: v32.25,67.25 32.38,67.25 U$1.BOOT0
  Bottom 0.292: v32.25,67.25 31.75,66.75 31.25,67 29.5,68.75 29.5,70 35.75,76.5 39.25,76.5 41.25,74.5 R2.2 44.9,73.65 47.5,75.75 47.5,84.75 48.77,86.17 51.76,86.15 52.02,86.41 52.02,86.42 52,90.79 JP4.5
GND  (via drill 0.6, 0.8, 0.8 pad 1.27)
  Top 0.292: C33.1 15.9,32.5 S1.B2 16.5,32.52 v14.7,32.55 | 17.35,26.65 17.35,26.1 | 32.5,47.75 33.43,47.75 U$1.VSS5 | C25.- 15.35,63.27 C24.2 C23.1 15.96,65.94 C26.- 14.56,65.69 v14.25,66.25 | v15.25,54.5 15.29,54.46 15.41,54.46 U$1.VSS2 17.26,56.3 17.5,56.6 17.75,56.85 18.5,56.85 19.16,57.41 19.17,59.08 18.03,60.27 U$1.VSSA 17.98,60.27 17.25,61 17.25,61.5 v18,62.25 | U$1.VSS4 24.42,47.23 | 17.33,39.75 v17.64,39.62 17.65,40.35 24.42,47.23 | v32.25,62 32.25,60 32.5,59.75 | 34.75,59.75 34.78,59.75 | 35.5,60.5 35.5,64.75 36.3,65.55 U$1.VSS9 | U$1.VSS8 39.76,61.94 37.35,59.37 | 41,55 41.65,55.65 42.52,55.65 43.18,54.99 U$1.VSS7 43.9,54.25 v44.75,54.25 | 36,53.25 36,52.96 U$1.VSS6 | 24.42,47.23 24.42,47.17 | C30.1 C29.1 18.25,70 21.25,67 22,66.75 22.25,66.63 U$1.VSS 24.9,64.02 26.5,64 27.75,62.75 27.75,61.25 29.25,59.75 | 38.86,57.21 38.75,57.48 | C31.1 36.06,76.13 v36.5,74.75 37.6,76 C32.1 38.6,76.5 39.25,76.5 39.76,77.01 39.75,77.02 39.73,82.54 37.48,82.54 36.34,82.53 35.98,82.72 v36,82.75 | X4.5 19.2,91.1 19.15,89.7 20.35,88.95 26.35,88.95 27.43,91.03 | 27.43,91.03 27.5,97 29.35,97 C34.2 29.5,98.35 29.75,98.7 33,98.7 33.25,98.75 | 33.25,98.75 33.33,98.67 IC3.26 IC3.25 | 33.25,98.75 33.6,98.8 36.35,98.8 36.58,98.67 IC3.21 36.58,96.17 36.59,95.02 36.75,94.61 36.75,94.5 38.25,94.5 38.5,95 38.5,97.6 IC3.18 | IC3.7 35.92,89.17 v35.5,88.5 | v27.5,93.5 27.5,96.76 27.43,91.03 | v15.25,45.75 15.9,45.75 U$1.VSS3 15.94,45.78 15.28,45.78 v15.25,45.75
  Top 0.406: 30.4,8.5 X1.5
  Top 0.559: 32.5,47.75 v31.25,49 33.5,51.25 34,51.25 36,53.25 37.75,55 40,55 | 34.78,59.75 35,60 35.5,60.5 | 41,55 40,55 | 40,55 39.25,55.75 38.75,57.48 37.35,59.37 36.54,57.97 35.53,57.97 34.75,58.75 34.75,59.75 32.5,59.75 29.25,59.75 | v40,58.25 38.86,57.21
  Top 0.61: 31,11.75 31,9.15 30.4,8.5
  Top 0.813: C27.1 26.75,26.77
  Top 1.27: J1.1 57.8,3 J1.2 57.8,10.8 C18.2 C20.2 56.35,16.9 56,17.25 53.25,17.25 53,17.5 | 53,17.5 53,19.81 | 53,19.81 JP7.2 53,20.19 | C21.2 24.45,17.35 C19.2 23.85,15.7 | 23.85,15.7 23.85,15.65 25.75,13 30.25,13 31,11.75 | IC2.1 1.72,9.03 C14.- C15.- 1.75,3 3,1.75 v4.5,1.75 9.5,1.75 10.35,2.6 C17.- C16.- | IC1.1 9.47,10.53 v10.5,9.5 | v3.25,22.75 5.54,22.75 JP3.59 JP3.60 | 17.75,26.1 C13.1 21.96,26.1 JP5.2 JP5.4 26.75,26.77 JP5.6 JP5.8 JP5.10 JP5.12 JP5.14 | 17.75,26.1 17.35,26.1 16,24.75 v16,20.5 16,18.8 LED1.C LED2.C 18.55,17.7 19.4,17.7 20,17 20,16.75 22.24,14.51 22.41,14.51 | 23.85,15.7 22.41,14.51 | 22.41,14.51 R8.2 | 53,20.19 53,22 53.25,22.25 | 53.25,22.25 53.27,22.27 JP4.60 53.25,23.92 53.25,22.25 | 53,20.19 53,19.81 | 53,17.5 52.75,17.25 35.62,17.25 30.67,12.3 | v16.5,27.5 16.5,27.35 17.75,26.1
  Bottom 0.292: 31.1,48.65 v31.25,49 | C3.1 36.74,44.52 36.5,44.52 | v18,62.25 v14.25,66.25 | C28.1 44.85,57.6 44.75,57.5 v44.75,54.25 | SJ2.2 41.01,58.25 v40,58.25 | v36.5,74.75 36.5,67.5 36,66.75 33.5,66.75 32.75,65.75 32.75,62.75 32.25,62.25 v32.25,62 32.38,61.9 32.35,61.9 C22.2 | v35.5,88.5 35.5,88 35.25,87.5 | 35.25,87.5 31.75,87.5 31.5,88 31.25,88 30,89.55 30,91.3 v27.5,93.5 | 35.25,87.5 35.25,83 v36,82.75 39.51,82.75 SJ1.2
  Bottom 0.61: 31.5,46.75 35.25,46.75 36.74,45.26 36.74,44.52
  Bottom 1.27: v10.5,9.5 10.5,13 | 10.5,13 7.25,16.25 4.5,16.25 | 4.5,16.25 3.75,16.25 1.75,14.25 1.75,3 3,1.75 v4.5,1.75 | 4.5,16.25 4.5,21.5 v3.25,22.75 | 10.5,13 10.5,15 v16,20.5 | C2.1 35.1,40.49 C1.1 C12.1 C11.1 C10.1 35.1,34.46 C8.1 | C9.1 C8.1 | C8.1 37.35,36.38 C7.1 C6.1 C5.1 37.37,42.44 C4.1 37.35,44.45 C3.1 | v16.5,27.5 14.7,29.6 v14.7,32.55 14.7,39.05 15.5,39.75 17.5,39.75 | 17.5,39.75 17.51,39.75 v17.64,39.62 24.62,39.62 31.25,46.25 31.25,46.5 | 17.5,39.75 17.5,43.5 v15.25,45.75 v15.25,54.5 | 31.25,48.5 v31.25,49 | 31.1,48.65 31.25,48.5 | 31.25,48.5 31.25,46.5 | 31.25,46.5 31.5,46.75
  other vias: 57.7,94.1 57.45,78.65 2.5,93.95 1.9,76 31,98.45 31.1,79.5 29.2,55.2
  pour Top (isolate 0.254): 0,0 60,0 60,100 0,100
  pour Bottom (isolate 0.279): 0,0 60,0 60,100 0,100
N$1  (via drill 0.8)
  Top 0.61: X1.1 26.25,8.5 26.25,10.75 22.57,10.75 22.57,9.09 21.75,9.09 v21.75,9.5
  Bottom 1.27: v21.75,9.5 33.25,9.5 33.25,11.5 42.75,11.5 JP1.1
N$2
  Top 1.27: J1.3 53.5,8.5 48.85,3.85 48.57,3.75 48.54,3.75 D1.A 48.34,3.75
N$3
  Top 1.27: D1.C 44.6,3.77 42.9,3.75 42.69,3.75 JP1.4
N$4
  Top 1.27: R3.2 LED1.A
N$5
  Bottom 0.292: SJ1.1 R2.1
N$6
  Top 1.27: R4.2 18.5,14.35 LED2.A
N$7  (via drill 0.8)
  Top 1.27: C18.1 51,12.25 47.75,8.75 JP2.2 42.77,8.75 JP1.2 | v21,7.5 18.75,7.5 C16.+ 16.35,7.4 14.75,9 14.48,9.75 IC1.3
  Bottom 1.27: JP1.2 35.25,8.77 33.75,3.39 22.5,3.39 v21,7.5
N$8  (via drill 0.6)
  Top 0.292: IC3.17 39.17,95.33 v39.42,95.15 | v31.25,93.5 30,93.5 C34.1
  Bottom 0.292: v39.42,95.15 39,95.5 38.75,95.5 38.5,95.75 38.5,97 38.25,97.25 36.5,97.25 35.75,96.5 35.75,95 34.25,93.5 v31.25,93.5
N$9  (via drill 0.6)
  Top 0.292: IC3.19 37.88,98.62 40.84,98.63 42.13,98.63 v42.7,98.1
  Bottom 0.292: v42.7,98.1 42.5,97.9 42.5,95.25 43,94.25 43,92.75 42,91.75 39.6,91.75 R6.2
N$10
  Top 0.292: IC3.23 35.27,92.72 35.75,92.25 42.65,92.25 R9.1
N$11  (via drill 0.6)
  Top 0.292: IC3.16 39.83,96.17 v40.77,95.59 | v23.4,92.55 23.4,90.3 23.2,89.58 21.75,89.58 21.6,89.85 21.5,92.55 X4.2
  Bottom 0.292: v40.77,95.59 39.5,96.5 39,98 35.95,98 35.1,97.1 35.1,95.6 34,94.5 26.6,94.5 26,92.65 v23.4,92.55
N$12  (via drill 0.6)
  Top 0.292: X4.3 20.75,93.95 20.85,94.4 v20.75,94.35 | v41.45,97.35 41.55,97.5 41.6,97.5 41.51,97.38 IC3.15
  Bottom 0.292: v20.75,94.35 21.4,96.6 34.25,96.5 34.2,97.3 35.3,98.7 41.15,98.7 v41.45,97.35
N$13
  Top 0.61: R8.1 29.55,11.65 X1.4
N$14
  Top 0.292: IC3.1 30.12,90.03 29.75,89.65 29.75,88.4 SJ14.2
N$15
  Top 0.292: IC3.5 34.62,92.12 34.5,92.25 28.5,92.25 28.5,90.9 27.5,89.8 27,88.35 23.25,88.35 23.1,88.3 23,88.25 SJ15.2
N$24  (via drill 0.6)
  Top 0.292: v31.15,68.47 31.25,69.66 U$1.PDR_ON
  Bottom 0.292: 41,62.75 40.99,62.76 SJ3.1 | SJ2.1 41.25,61.01 41.25,62.5 41,62.75 | 41,62.75 SJ3.1 39.5,63 39.75,74.25 38.5,75.75 36,75.75 31.5,71.25 v31.15,68.47
N$26
  Top 0.292: LED3.C R9.2
N$27
  Top 0.292: R5.2 46.05,96.2 LED4.C
N$28
  Top 0.292: SJ5.1 28.25,77.75 33.1,77.75 | 33.1,77.75 C31.2 | 33.1,77.75 Q2.1
N$29  (via drill 0.6)
  Top 0.292: C32.2 38.65,78.5 v36.25,78.5 36.25,79.35 Q2.4
  Bottom 0.292: SJ4.1 34.04,76.21 34.58,76.75 v36.25,78.5
N$30
  Top 0.292: IC3.22 35.92,95.58 36,95.25 36,93.75 40.75,93.75 42,94.75 42,96.2 42.55,96.95 R5.1
N$31
  Top 0.292: IC3.11 38.52,87.53 38.25,86.75 33.5,86.75 33.23,87.97 33.23,88.08 33.25,89 IC3.3
NRST  (via drill 0.6)
  Top 0.292: C33.2 15.4,37 S1.A2 v18.25,37 | v42.25,29 42.75,28.5 42.75,23.75 45.19,21.31 JP7.5 | U$1.NRST 20.17,62.38 v19.18,63.37
  Bottom 0.292: v42.25,29 21.5,29 21.5,33.75 v18.25,37 18.25,27.25 17.25,26.25 13.25,26.25 12,25.18 5.5,25.18 4.5,26 4.5,51 2.5,53 2.5,55.5 1.75,56.25 1.75,66 4.5,69.25 6.32,69.25 JP3.23 8.07,71 11,71 11,68.5 11.75,67.75 14.5,67.75 18.88,63.37 v19.18,63.37
OSC_IN  (via drill 0.6)
  Top 0.292: U$1.PH0/OSC_IN 20.89,63.03 22.22,61.74 22.5,61.46 22.52,60.76 25.25,58 v26.5,58 | C30.2 20.75,75.9 19.75,77 | 19.75,77 19.25,77.5 v18.25,77.5 | 19.75,77 21.83,77 Q1.2
  Bottom 0.292: SJ7.2 16.75,77.25 | 16.75,77.25 17.75,77.25 | 17.75,77.25 v18.25,77.5 18,77.25 17.75,77.25 | 16.75,77.25 17,77 17,75.5 18,74.5 18,74 18.5,73.5 18.5,70.25 25.25,63.5 25.8,62.25 25.98,61.68 25.94,61.87 26.51,60.41 26.5,60.3 v26.5,58
OSC_OUT  (via drill 0.6)
  Top 0.292: v16.5,74.75 17.9,74.75 C29.2 18.25,75.25 17,76.5 16.7,76.75 16.45,77 16.42,77.22 Q1.1 | U$1.PH1/OSC_OUT 20.57,62.67 21.71,61.5 21.72,61.51 21.98,61.23 22.04,60.52 23.75,58.75 23.75,57.5 v24.5,57.25 24.5,57
  Bottom 0.292: SJ6.2 v16.5,74.75 17.25,74 17.25,73.75 17.75,73.25 17.75,70 25,62.5 25.65,60.76 25.66,60.75 25.75,60.5 25.75,59 25.25,58.75 25.25,57.5 24.5,57 v24.5,57.25
PA0  (via drill 0.6)
  Top 0.292: U$1.PA0 v18.02,58.14
  Bottom 0.292: v18.02,58.14 17.86,58.14 12.25,63.75 12,63.75 11.25,64.5 9.35,64.5 JP3.28
PA1  (via drill 0.6)
  Top 0.292: U$1.PA1 16.56,58.94 15.75,59.75 15,59.75 v14.75,59.5
  Bottom 0.292: v14.75,59.5 14.5,59.5 10.75,63.25 7.94,63.25 JP3.29
PA2
  Top 0.292: U$1.PA2 13.21,58.54 12,59.75 12,60 10.5,61.5 9.81,61.5 JP3.30
PA3
  Top 0.292: U$1.PA3 15.75,55.5 13.5,55.5 13.25,55.75 13.25,57.25 10.5,60 10.5,60.5 10.25,60.75 8,60.75 6.75,59.5 JP3.31
PA4
  Top 0.292: U$1.PA4 15.88,53.5 14.5,53.5 12.5,55.5 12.5,57 10,59.5 JP3.32
PA5
  Top 0.292: U$1.PA5 16.08,53 14,53 11.85,55.15 11.85,56.57 10.25,58.17 8.19,58.17 6.98,56.96 JP3.33
PA6
  Top 0.292: U$1.PA6 16.29,52.5 13.5,52.5 11.25,54.75 11.25,56 10.29,56.96 JP3.34
PA7
  Top 0.292: U$1.PA7 16.5,52 13,52 10.5,54.5 10.5,55.5 10.3,55.7 7.98,55.7 6.73,54.45 JP3.35
PA8
  Top 0.292: U$1.PA8 43.7,49.5 47.75,49.5 49.5,51.25 49.5,53 49.7,53.2 52.3,53.2 53.27,54.17 JP4.36
PA9
  Top 0.292: U$1.PA9 43.91,50 47.5,50 49,51.5 49,53.75 49.67,54.42 JP4.35
PA10
  Top 0.292: U$1.PA10 44.12,50.5 47.25,50.5 48.5,51.75 48.5,54.5 49.72,55.72 52.06,55.72 53.27,56.93 JP4.34
PA11
  Top 0.292: U$1.PA11 44.32,51 47,51 48,52 48,55 49.96,56.96 JP4.33
PA12
  Top 0.292: U$1.PA12 44.53,51.5 46.75,51.5 47.5,52.25 47.5,55.5 50.25,58.25 52,58.25 53.25,59.5 JP4.32
PA13
  Top 0.292: U$1.PA13 44.74,52 46.5,52 47,52.5 47,56 50.5,59.5 JP4.31
  Bottom 0.292: JP7.4 47.73,51.73 48.25,52.25 48.25,57.02 JP4.31
PA14
  Top 0.292: U$1.PA14 44.63,59 46.5,59 48.25,60.75 52.25,60.75 53.27,61.77 JP4.30
  Bottom 0.292: JP7.3 50.27,21.02 51.25,22 55.25,22 55.5,23 55.5,59.81 JP4.30
PA15
  Top 0.292: U$1.PA15 44.42,59.5 46,59.5 48.54,62.04 JP4.29
PB0
  Top 0.292: U$1.PB0 17.12,50.5 11.5,50.5 10.12,51.88 JP3.38
PB1
  Top 0.292: U$1.PB1 17.32,50 11,50 10.4,50.6 7.91,50.6 6.73,49.42 JP3.39
PB2
  Top 0.292: U$1.PB2 17.37,49.34 JP3.40
PB3  (via drill 0.6)
  Top 0.292: v34.02,65.58 34.25,65.62 U$1.PB3 37.66,69 39.5,69.75 44.5,74.75 44.5,75.75 45.5,76.75 45.5,78 46.5,79 46.5,82 49.5,85 49.5,85.5 50.17,86.17 51.96,86.17 53.23,87.44 JP4.10
  Bottom 0.292: JP7.6 42.65,25.15 44,26.5 44,51.25 43.25,52 43.25,56 42.5,56 41.25,57.25 38.75,57.25 36.5,60.25 36.5,62.75 v34.02,65.58
PB4
  Top 0.292: U$1.PB4 37.45,69.5 39.25,70.25 44,75 44,76 45,77 45,78.25 46,79.25 46,82.25 49,85.25 49,86.5 49.94,87.44 JP4.9
PB5
  Top 0.292: U$1.PB5 37.25,70 39,70.75 43.5,75.25 43.5,76.25 44.5,77.25 44.5,78.5 45.5,79.5 45.5,82.5 48.5,85.5 48.5,86.75 49.5,87.75 49.5,88.5 49.75,88.75 52,88.75 53.23,89.98 JP4.8
PB6  (via drill 0.6)
  Top 0.292: U$1.PB6 37.04,70.5 38.75,71.25 43,75.5 43,76.5 44,77.5 44,78.75 45,79.75 45,82.75 48,85.75 48,87 49,88 49,89.25 49.73,89.98 JP4.7 | SJ15.1 24.52,86.98 25.35,86.15 29.35,86.15 30,85.5 41,85.5 v42.5,87
  Bottom 0.292: v42.5,87 47.75,87 JP4.7
PB7  (via drill 0.6)
  Top 0.292: U$1.PB7 36.83,71 38.5,71.75 42.5,75.75 42.5,76.75 43.5,77.75 43.5,79 44.5,80 44.5,83 47.5,86 47.5,87.25 48.5,88.25 48.5,89.75 50,91.25 52,91.25 JP4.6 | SJ14.1 30.95,87.52 31.05,86.25 31.4,86 39.25,86 42,88.75 v43.5,88.75
  Bottom 0.292: v43.5,88.75 43.75,89.25 46.25,89.25 49.5,93.75 52.25,93.75 53.27,92.73 JP4.6
PB8
  Top 0.292: U$1.PB8 35.92,71.5 38.25,72.25 42,76 42,78.5 44,80.5 44,83.25 47,86.25 47,87.5 48,88.5 48,90 49,91 49,93.25 49.56,93.81 51.95,93.81 53.2,95.06 JP4.4
PB9
  Top 0.292: U$1.PB9 35.71,72 38,72.75 41.5,76.25 41.5,78.75 43.5,80.75 43.5,83.5 46.5,86.5 46.5,87.75 47.5,88.75 47.5,90.25 48.5,91.25 48.5,93.75 49.81,95.06 JP4.3
PB10
  Top 0.292: U$1.PB10 21.5,38.62 21.5,32 18.75,29 14.25,29 13,27.75 8,27.75 JP3.57 5.25,27.96 5.25,90.75 5.75,91.25 10.75,91.25 11.75,90.5 11.75,88.75 13.45,87.05 SJ15.3
PB11  (via drill 0.6)
  Top 0.292: U$1.PB11 22,38.42 22,31.75 19,28.5 14.5,28.5 12.48,26.48 JP3.58 8.04,25.17 5.75,25.17 4.25,26.75 4.25,88.5 4.5,89 4.5,93.25 5.75,93.75 11.75,93.75 12.75,92.75 12.7,90.6 13.75,89.55 v17.95,89.55 | SJ14.3 28.28,88.98 v28.65,89.65
  Bottom 0.292: v28.65,89.65 20,89.55 v17.95,89.55
PB12
  Top 0.292: U$1.PB12 50.17,23.94 JP4.59
PB13
  Top 0.292: U$1.PB13 49.57,25.25 52.5,25.25 53.27,26.02 JP4.58
PB14
  Top 0.292: U$1.PB14 49.05,26.48 JP4.57
PB15
  Top 0.292: U$1.PB15 48.48,27.75 52.25,27.75 53.27,28.77 JP4.56
PC0  (via drill 0.6)
  Top 0.292: U$1.PC0 19.83,62 22.02,59.81 22.24,59.57 23.11,58.68 23.12,57.13 24,56.25 24,54 24.25,53.75 24.25,52.5 v24,51.75
  Bottom 0.292: JP3.24 8.01,68.36 4.9,68.36 2.5,65.75 2.5,56.5 3.5,55.5 3.5,53 5.88,50.62 10.27,50.62 12.25,52.6 12.25,54.25 13.75,55.75 16.25,55.75 16.5,55.5 16.5,54.75 19.5,51.75 v24,51.75
PC1  (via drill 0.6)
  Top 0.292: U$1.PC1 19.48,61.66 21.48,59.63 22.5,58.5 22.5,56.75 23.25,56 v23.25,53
  Bottom 0.292: JP3.25 6.6,67.25 5.5,67.25 3.25,65.06 3.25,56.75 4,56 4,55 5.83,53.17 10.22,53.17 11.25,54.2 11.25,54.75 12,56.25 16.75,56.25 20.25,52.75 23,52.75 v23.25,53
PC2  (via drill 0.6)
  Top 0.292: U$1.PC2 19.12,61.31 21,59.38 21,59.35 21.75,58.5 22,58.25 v22,54.25
  Bottom 0.292: JP3.26 8.13,65.89 5.23,65.89 4,64.75 4,57 5.36,55.64 10.27,55.64 10.88,56.75 17.75,56.75 20.5,54 21.75,54 v22,54.25
PC3  (via drill 0.6)
  Top 0.292: U$1.PC3 18.79,60.97 20.53,59.1 20.5,57.25 | 20.5,57.25 20.5,57 v20.74,57.27 | v20.74,57.27 20.75,57.25 20.5,57.25 | v20.74,57.27 20.5,57.25
  Bottom 0.292: JP3.27 6.56,64.75 5.25,64.75 4.75,64.25 4.75,58.5 5,58.25 10.75,58.25 12,57.5 12.46,57.3 v20.74,57.27
PC4
  Top 0.292: U$1.PC4 16.7,51.5 12.5,51.5 9.58,54.42 JP3.36
PC5
  Top 0.292: U$1.PC5 16.91,51 12,51 9.88,53.12 8.01,53.12 6.77,51.88 JP3.37
PC6
  Top 0.292: U$1.PC6 42.87,47.5 49.25,47.5 49.83,48.08 51.97,48.08 53.23,49.34 JP4.40
PC7
  Top 0.292: U$1.PC7 43.08,48 48.75,48 50.09,49.34 JP4.39
PC8
  Top 0.292: U$1.PC8 43.29,48.5 48.25,48.5 50.34,50.59 52.15,50.59 53.27,51.71 JP4.38
PC9
  Top 0.292: U$1.PC9 43.49,49 48,49 50.73,51.73 JP4.37
PC10
  Top 0.292: U$1.PC10 44.21,60 45.5,60 48.75,63.25 52.25,63.25 53.27,64.27 JP4.28
PC11
  Top 0.292: U$1.PC11 44,60.5 45,60.5 48.5,64 50.15,64 JP4.27
PC12
  Top 0.292: JP4.26 51.9,65.81 49.32,65.81 44.5,61 43.8,61 U$1.PC12
PC13  (via drill 0.6)
  Top 0.292: U$1.PC13 25,70.25 v25,72.5
  Bottom 0.292: v25,72.5 24.75,73.25 24.75,74.5 24.25,75 24.25,80.75 21.25,83.75 13,83.75 10.75,86 10.75,88.25 10.31,88.69 7.99,88.69 6.73,89.95 JP3.7
PC14  (via drill 0.6)
  Top 0.292: v31.25,63.25 31.05,63.25 v28.5,65.8 28.25,66.05 28.25,66.25 26.3,68.19 U$1.PC14
  Bottom 0.292: v31.25,63.25 31.75,63.75 31.75,65.25 29,68 28.75,68.75 28.75,70.25 31.96,73.71 SJ4.2 | JP3.8 9.75,89.5 10.5,89.5 11.5,88.5 11.5,86.25 13.25,84.5 21.5,84.5 25,81 25,75.25 25.85,74.31 25.85,72.06 25.25,71.5 25.25,69.25 28.5,66 v28.5,65.8
PC15
  Top 0.292: U$1.PC15 24.08,69.75 24,70.25 24,71 24.04,72.71 SJ5.2 24.25,75.67 24.25,76.25 27.75,79.75 29.5,79.75 30.25,80.5 30.25,84.25 29,85.5 13.5,85.5 10.32,88.68 7.97,88.68 JP3.9
PD0
  Top 0.292: U$1.PD0 43.59,61.5 44,61.5 49.62,67.12 JP4.25
PD1
  Top 0.292: U$1.PD1 43.38,62 44.74,63.35 49.62,68.37 51.99,68.37 JP4.24
PD2
  Top 0.292: U$1.PD2 43.93,63.25 44.25,64 49.91,69.66 JP4.23
PD3
  Top 0.292: U$1.PD3 43.47,63.5 44,65.25 49.67,70.92 52.24,70.92 53.27,71.95 JP4.22
PD4
  Top 0.292: U$1.PD4 43.01,63.75 43.5,65.5 50.2,72.2 JP4.21
PD5
  Top 0.292: U$1.PD5 42.56,64 43,65.75 49.5,72.25 49.5,73 50,73.5 52.25,73.5 53.27,74.52 JP4.20
PD6
  Top 0.292: U$1.PD6 40.94,64.5 42,65.5 49,72.5 49,73.25 50.49,74.74 JP4.19
PD7
  Top 0.292: U$1.PD7 40.73,65 41.75,66 48.5,72.75 48.5,73.5 49.5,74.5 49.5,75.75 49.75,76 52,76 JP4.18
PD8
  Top 0.292: U$1.PD8 47.92,29.02 JP4.55
PD9
  Top 0.292: U$1.PD9 47.4,30.25 52,30.25 53.27,31.52 JP4.54
PD10
  Top 0.292: U$1.PD10 46.8,31.56 JP4.53
PD11
  Top 0.292: U$1.PD11 46.24,32.82 52.02,32.82 53.27,34.07 JP4.52
PD12
  Top 0.292: U$1.PD12 45.67,34.1 JP4.51
PD13
  Top 0.292: U$1.PD13 45.15,35.33 52.05,35.33 53.27,36.55 JP4.50
PD14
  Top 0.292: U$1.PD14 45.96,36.64 JP4.49
PD15
  Top 0.292: U$1.PD15 45.43,37.87 51.97,37.87 JP4.48
PE0
  Top 0.292: U$1.PE0 35.5,72.5 37.75,73.25 41,76.5 41,79 43,81 43,83.75 46,86.75 46,88 47,89 47,90.5 48,91.5 48,94 49.5,95.5 49.5,96.25 49.54,96.29 52.15,96.29 53.27,97.41 JP4.2
PE1
  Top 0.292: U$1.PE1 35.3,73 37.5,73.75 40.5,76.75 40.5,79.25 42.5,81.25 42.5,84 45.5,87 45.5,88.25 46.5,89.25 46.5,90.75 47.5,91.75 47.5,94.25 48.97,95.75 48.97,97 49.6,97.6 JP4.1
PE2  (via drill 0.6)
  Top 0.292: U$1.PE2 30.75,72.57 v30.75,74
  Bottom 0.292: JP3.1 8.24,98.8 10.11,98.8 14,95 14,93.5 16,91.5 16,89 16.35,88.65 23.35,88.65 29.5,82.5 29.5,78.25 30.25,77.5 30.25,74.5 v30.75,74
PE3  (via drill 0.6)
  Top 0.292: U$1.PE3 27.78,71 27.75,71.1 27.75,71.5 28.25,72 28.75,72 29.25,72.5 29.25,73.25 v29.5,73.5
  Bottom 0.292: v29.5,73.5 29.5,77 28.75,77.75 28.75,82.25 23,88 15.75,88 15.25,88.5 15.25,91.25 13.25,93.25 13.25,94.5 10.15,97.6 JP3.2
PE4  (via drill 0.6)
  Top 0.292: v28.5,76.25 28.5,72.75 27.25,72 27.25,70.82 U$1.PE4
  Bottom 0.292: JP3.3 7.96,96.29 10.51,96.29 12.5,94.3 12.5,93 14.5,91 14.5,87.75 15,87.25 22.75,87.25 28,82 28,76.25 v28.5,76.25
PE5  (via drill 0.6)
  Top 0.292: U$1.PE5 26.75,70.61 26.75,72.25 27.25,72.75 v27.5,73.25
  Bottom 0.292: v27.5,73.25 28.5,74 28.5,74.75 27.25,76 27.25,81.75 22.5,86.5 14.5,86.5 13.75,87.25 13.75,90.75 11.75,92.75 11.75,93.75 10.44,95.06 JP3.4
PE6  (via drill 0.6)
  Top 0.292: U$1.PE6 26.03,70.66 26.03,73.25 v27.5,74.5
  Bottom 0.292: v27.5,74.5 27.25,74.5 27.25,75 26.5,75.75 26.5,81.5 22.15,85.85 13.9,85.85 13,86.75 13,90.5 11,92.5 11,93.25 10.44,93.81 8,93.81 6.73,92.54 JP3.5
PE7
  Top 0.292: U$1.PE7 15.6,40.5 13,40.5 11.68,39.18 JP3.48
PE8
  Top 0.292: U$1.PE8 15.81,40 13.25,40 11.15,37.9 8.1,37.9 6.84,36.64 JP3.49
PE9
  Top 0.292: U$1.PE9 16.01,39.5 13.5,39.5 10.64,36.64 JP3.50
PE10
  Top 0.292: U$1.PE10 18.5,39.87 18.5,38.75 13.75,38.75 12,37.25 12,35.25 8.25,35.25 7.1,34.1 JP3.51
PE11
  Top 0.292: JP3.52 12.4,34.1 12.5,34.2 12.5,37 14,38.25 19,38.25 19,39.5 19.09,39.75 U$1.PE11
PE12
  Top 0.292: JP3.53 6.81,31.56 8,32.75 10,32.75 11.5,31.25 18,31.25 19.5,33 19.5,39.41 19.55,39.5 U$1.PE12
PE13
  Top 0.292: JP3.54 10.19,31.56 11,30.75 18.25,30.75 20,32.75 20,39.25 U$1.PE13
PE14
  Top 0.292: JP3.55 7.27,29.02 8.5,30.25 18.5,30.25 20.5,32.5 20.5,39.04 U$1.PE14
PE15
  Top 0.292: JP3.56 13.52,29.02 14,29.5 18.5,29.5 21,32.25 21,38.83 U$1.PE15
PF0
  Top 0.292: U$1.PF0 23.5,69.62 23.5,76.5 27.5,80.5 29.25,80.5 29.5,80.75 29.5,84 29,84.5 13,84.5 10.06,87.44 JP3.10
PF1  (via drill 0.6)
  Top 0.292: U$1.PF1 25.67,66.75 29.75,62.5 v30,61.75
  Bottom 0.292: v30,61.75 29.5,62.75 29.25,63 28.75,63 26.25,66.5 24.65,68 24.65,71.25 24,72 24,73.75 23.5,74.25 23.5,80.25 20.5,83 12.75,83 10.5,85.25 10.5,85.5 9.75,86.25 8,86.25 6.73,84.98 JP3.11
PF2  (via drill 0.6)
  Top 0.292: U$1.PF2 26.01,65.6 26.4,65.1 28.75,62.75 v28.75,61.75
  Bottom 0.292: v28.75,61.75 28,62.5 26.98,64.42 26.75,64.75 25.75,66 24,67.75 24,71 23.25,71.75 23.25,73 22.75,73.5 22.75,79.5 20,82.25 12.5,82.25 9.85,84.9 JP3.12
PF3  (via drill 0.6)
  Top 0.292: U$1.PF3 22.61,68.45 v22.64,69.52
  Bottom 0.292: v22.64,69.52 22.75,69.75 22.82,69.82 22.82,70.86 22.61,71.42 22.61,72.67 22.08,73.17 22.08,79.23 19.81,81.5 11.75,81.5 10.5,82.75 10.5,83.25 10.15,83.6 7.89,83.6 6.73,82.44 JP3.13
PF4  (via drill 0.6)
  Top 0.292: U$1.PF4 21.75,68.55 21.75,70 v21.87,70.6
  Bottom 0.292: v21.87,70.6 21.87,70.63 22,70.75 22,72.25 21.5,72.75 21.5,79 19.75,80.75 17,80.75 16.88,80.87 11.48,80.87 9.99,82.36 JP3.14
PF5  (via drill 0.6)
  Top 0.292: U$1.PF5 21,68.59 v21,71.5
  Bottom 0.292: v21,71.5 20.75,71.5 20.75,78.75 19.5,80 16.5,80 16.25,80.25 11,80.25 10.25,81 7.91,81 JP3.15
PF6  (via drill 0.6)
  Top 0.292: U$1.PF6 22.73,64.77 24.68,62.8 25.55,62.85 26.5,61.9 26.6,60.55 27.4,59.75 v29,58
  Bottom 0.292: v29,58 27.25,62.25 26.75,63.5 26.5,64 25.75,65 20,70.75 20,78.5 19.25,79.25 16.25,79.25 16,79.5 9.59,79.5 JP3.16
PF7  (via drill 0.6)
  Top 0.292: U$1.PF7 24.53,62.24 25.1,62.25 25.8,61.55 25.9,60.4 26.15,60.15 27,59.25 27.25,59 v27.75,58
  Bottom 0.292: v27.75,58 27.25,59 27.25,60.25 25.75,64 19.25,70.5 19.25,78.25 19,78.5 16,78.5 15.75,78.75 12.25,78.75 11.75,78.25 11.75,77.75 10,76 8.01,76 JP3.17
PF8  (via drill 0.6)
  Top 0.292: U$1.PF8 21.98,64.06 22.66,63.38 23.19,62.86 23.72,62.29 24.25,61.75 24.84,61.42 v24.86,59.81 | v16.25,73.5 15.5,73.5 14.5,74.5 12.05,74.5 JP3.18
  Bottom 0.292: v24.86,59.81 25,60 24.91,60.09 24.91,61.09 24.5,62.25 17,70 17,73 v16.25,73.5
PF9  (via drill 0.6)
  Top 0.292: U$1.PF9 21.63,63.71 22.56,62.73 22.53,62.78 22.99,62.25 23,61.75 23.86,61 v23.94,60.89 23.75,61 | v16,72.25 15.5,72.25 15,72 11.25,72 9.75,73.5 7.97,73.5 JP3.19
  Bottom 0.292: v23.94,60.89 22.75,62.25 21.23,63.77 21.17,64.97 19.88,66.27 19.44,66.31 16,69.75 v16,72.25
PF10  (via drill 0.6)
  Top 0.292: U$1.PF10 v20.02,64.62 | v14,73 11.76,73 JP3.20
  Bottom 0.292: v20.02,64.62 20.13,64.37 15,69.5 15,72.75 v14,73
PF11
  Top 0.292: U$1.PF11 16.19,47.45 11.2,47.45 10.19,48.06 7.86,48.06 6.73,46.93 JP3.41
PF12
  Top 0.292: U$1.PF12 16.24,46.8 JP3.42
PF13
  Top 0.292: U$1.PF13 16.41,44.85 11.35,44.85 10.5,45.5 8,45.5 6.76,44.26 JP3.43
PF14
  Top 0.292: U$1.PF14 16.53,44.26 JP3.44
PF15
  Top 0.292: U$1.PF15 14.98,42 12,42 11,43 8,43 JP3.45
PG0
  Top 0.292: U$1.PG0 15.19,41.5 11.25,41.5 11.03,41.72 JP3.46
PG1
  Top 0.292: U$1.PG1 15.39,41 12.75,41 12.15,40.4 8.09,40.4 6.87,39.18 JP3.47
PG2
  Top 0.292: U$1.PG2 44.83,39.18 JP4.47
PG3
  Top 0.292: U$1.PG3 44.22,40.5 52,40.5 53.22,41.72 JP4.46
PG4
  Top 0.292: U$1.PG4 43.7,41.72 JP4.45
PG5
  Top 0.292: U$1.PG5 43.13,43 51.75,43 53.01,44.26 JP4.44
PG6
  Top 0.292: U$1.PG6 42.58,44.26 JP4.43
PG7
  Top 0.292: U$1.PG7 42.05,45.5 51.75,45.5 53.05,46.8 JP4.42
PG8
  Top 0.292: U$1.PG8 41.45,46.8 JP4.41
PG9
  Top 0.292: U$1.PG9 40.52,65.5 41.5,66.5 48,73 48,73.75 49,74.75 49,76.25 50.03,77.28 JP4.17
PG10
  Top 0.292: U$1.PG10 40.31,66 41.25,67 47.5,73.25 47.5,74 48.5,75 48.5,76.5 49.5,77.5 49.5,78.25 49.75,78.5 52,78.5 53.27,79.77 JP4.16
PG11
  Top 0.292: U$1.PG11 40.1,66.5 41.25,67.75 47,73.5 47,74.25 48,75.25 48,76.75 49,77.75 49,78.75 50.07,79.82 JP4.15
PG12
  Top 0.292: U$1.PG12 39.88,67.03 40.75,68 46.5,73.75 46.5,74.5 47.5,75.5 47.5,77 48.5,78 48.5,80 49.56,81.06 52.05,81.06 53.27,82.28 JP4.14
PG13
  Top 0.292: U$1.PG13 39.53,67.41 40.5,68.5 46,74 46,75 47,76 47,77.25 48,78.25 48,81 49.36,82.36 JP4.13
PG14
  Top 0.292: U$1.PG14 38.89,67.5 40,68.75 45.5,74.25 45.5,75.25 46.5,76.25 46.5,77.5 47.5,78.5 47.5,81.5 49.6,83.6 52.1,83.6 53.27,84.77 JP4.12
PG15
  Top 0.292: U$1.PG15 37.87,68.5 39.75,69.25 45,74.5 45,75.5 46,76.5 46,77.75 47,78.75 47,81.75 50.15,84.9 JP4.11
PH0
  Bottom 0.292: JP3.21 6.73,72.23 8,73.5 10.75,73.5 11.5,74.25 11.5,75.26 SJ7.1
PH1
  Bottom 0.292: JP3.22 11.19,72.2 SJ6.1
VBAT  (via drill 0.6)
  Top 0.292: v30,65.75 28.5,67.45 U$1.VBAT
  Bottom 0.292: C22.1 31.09,61.49 31.09,61.91 31,62 29.96,63.38 v30,65.75 30,66 26,70 26,71 26.5,71.5 26.5,74.5 25.75,75.25 25.75,81.25 21.85,85.15 13.6,85.15 12.25,86.5 12.25,88.75 10.75,90.25 10.75,91.04 JP3.6
VCAP1
  Top 0.292: U$1.VCAP_1 27,42.71 26.98,42.68 26.73,42.43 C27.2
VCAP2  (via drill 0.6)
  Top 0.292: U$1.VCAP_2 44.44,53 v45.75,53
  Bottom 0.292: v45.75,53 46.25,53.5 C28.2
VDDA
  Top 0.292: U$1.VDDA 16.36,60.5 15.75,60.5 14.69,61.56 C24.1 12.82,61.56 C25.+ 11.94,63.19 12.5,63.75 12.5,66 R1.2 12.15,67.1 11.25,68 11.25,68.25 12.5,69.5 12.5,70.5 L1.1
VREF+
  Top 0.292: U$1.VREF+ 17.64,59.96 16.56,61.04 16.47,62.11 18.91,64.55 18.5,65.56 C23.2 18.45,67.17 C26.+ 16.81,68.06 16,67.25 15.5,67.75 14.25,67.75 R1.1

### Text on the board
tNames: PE2 | PE3 | PE1 | PE0 | PE4 | PE5 | PB9 | PB8 | PE6 | VBAT | PB7 | BOOT0 | PC13 | PC14 | PB6 | PB5 | PC15 | PF0 | PB4 | PB3 | PF1 | PF2 | PG15 | PG14 | PF3 | PF4 | PG13 | PG12 | PF5 | PF6 | PG11 | PG10 | PF7 | PF8 | PG9 | PD7 | PF9 | PF10 | PD6 | PD5 | PH0 | PH1 | PD4 | PD3 | NRST | PC0 | PD2 | PD1 | PC1 | PC2 | PD0 | PC12 | PC3 | PC11 | PC10 | PA0 | PA1 | PA15 | PA14 | PA2 | PA3 | PA4 | PA13 | PA12 | PA5 | PA6 | PA11 | PA10 | PA7 | PC4 | PA9 | PA8 | PC5 | PB0 | PC9 | PC8 | PB1 | PB2 | PC7 | PC6 | PF11 | PF12 | PG8 | PG7 | PF13 | PF14 | PG6 | PG5 | PF15 | PG0 | PG4 | PG3 | PG1 | PE7 | RESET | PG2 | PD15 | PE8 | PE9 | PD14 | PD13 | PE10 | PD12 | PD11 | PE11 | STM32F4 SHIELD | PD9 | PE12 | PE13 | PD10 | PE14 | PE15 | by Dawid Szromek | PD8 | PB15 | PB10 | PB11 | GND | PB14 | PB13 | GND | GND | 3V3 | PB12 | GND | 5V | 3V3 | SWO | NRST | GND | SWDIO | SWCLK | USB / 5V | EXT / DC